# EAGLE schematic pdp8l (EAGLE 6.6.0), part 2 of 2
## Sheet 12 of 23
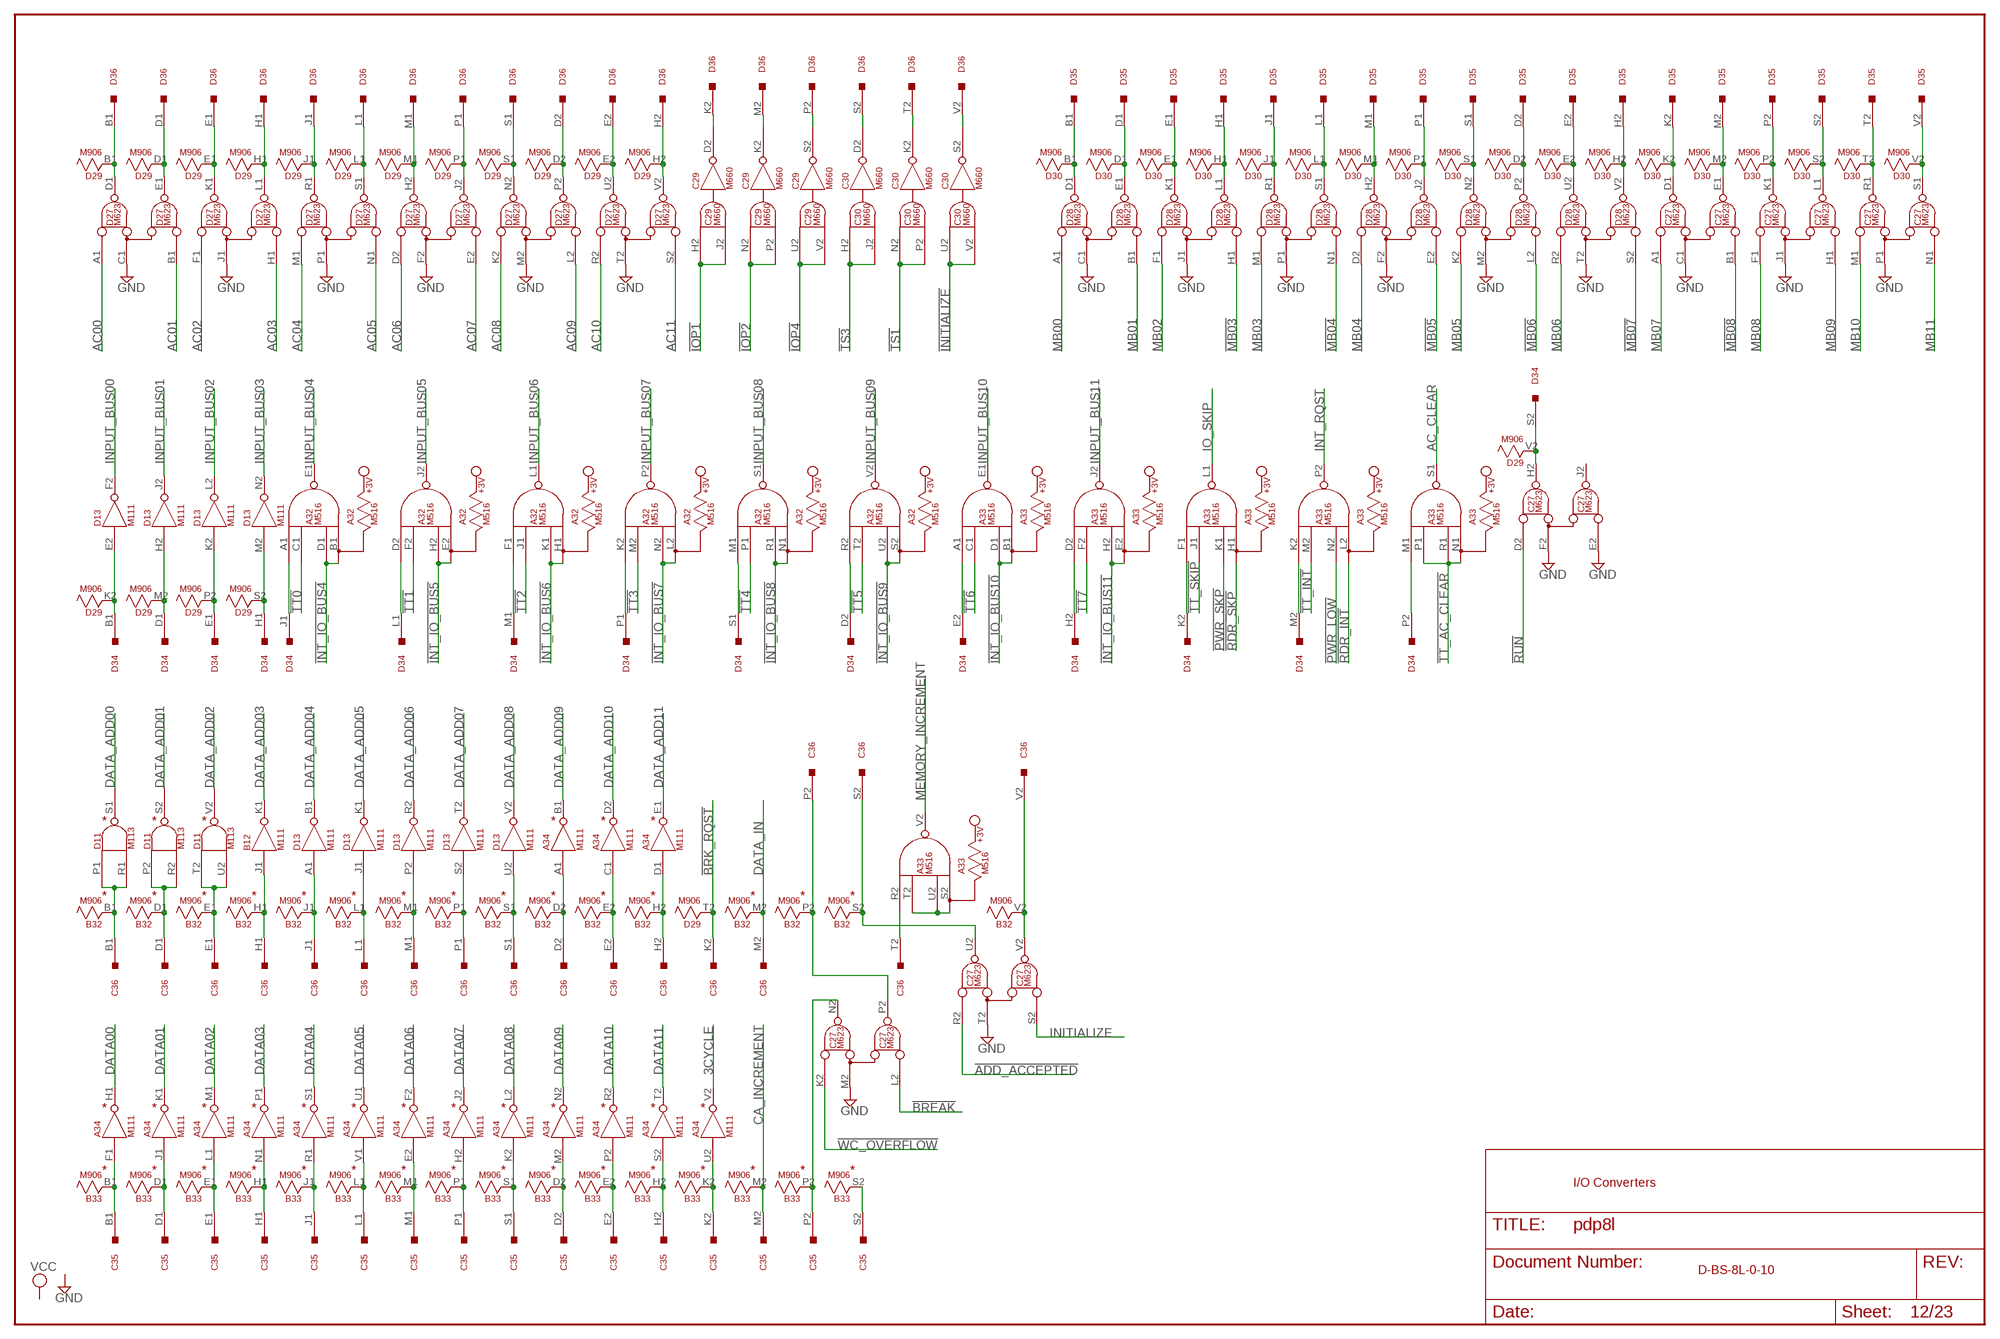
[diagram p11: schematic, sheet 12]

### Parts
A32  M516  [H807]
A33  M516  [H807]
A34  M111  [H807]
B32  M906  [H807]
B33  M906  [H807]
C27  M623  [H807]
C29  M660  [H807]
C30  M660  [H807]
C35  M903  [H807]
C36  M903  [H807]
D27  M623  [H807]
D28  M623  [H807]
D29  M906  [H807]
D30  M906  [H807]
D34  M903  [H807]
D35  M903  [H807]
D36  M903  [H807]

### Nets
3CYCLE: A34.V2(V2:OUT) ; also sheet 2
!3CYCLE: A34.U2(V2:IN) B33.K2 C35.K2
!ADD_ACCEPTED: C27.R2(U2:A) ; also sheet 6
!BAC_CLEAR: A33.M1(S1:IN) D34.P2
!BADD_ACCEPTED: B32.S2 C27.U2(U2:D) C36.S2
!BADDR00: B32.B1 C36.B1 D11.P1(S1:IN1) D11.R1(S1:IN2)
!BADDR01: B32.D1 C36.D1 D11.P2(S2:IN1) D11.R2(S2:IN2)
!BADDR02: B32.E1 C36.E1 D11.T2(V2:IN1) D11.U2(V2:IN2)
!BADDR03: B12.J1(K1:IN) B32.H1 C36.H1
!BADDR04: B32.J1 C36.J1 D13.A1(B1:IN)
!BADDR05: B32.L1 C36.L1 D13.J1(K1:IN)
!BADDR06: B32.M1 C36.M1 D13.P2(R2:IN)
!BADDR07: B32.P1 C36.P1 D13.S2(T2:IN)
!BADDR08: B32.S1 C36.S1 D13.U2(V2:IN)
!BADDR09: A34.A1(B1:IN) B32.D2 C36.D2
!BADDR10: A34.C1(D2:IN) B32.E2 C36.E2
!BADDR11: A34.D1(E1:IN) B32.H2 C36.H2
!BBREAK: B32.P2 C27.P2(N2:E) C36.P2
!BDATA00: A34.F1(H1:IN) B33.B1 C35.B1
!BDATA01: A34.J1(K1:IN) B33.D1 C35.D1
!BDATA02: A34.L1(M1:IN) B33.E1 C35.E1
!BDATA03: A34.N1(P1:IN) B33.H1 C35.H1
!BDATA04: A34.R1(S1:IN) B33.J1 C35.J1
!BDATA05: A34.V1(U1:IN) B33.L1 C35.L1
!BDATA06: A34.E2(F2:IN) B33.M1 C35.M1
!BDATA07: A34.H2(J2:IN) B33.P1 C35.P1
!BDATA08: A34.K2(L2:IN) B33.S1 C35.S1
!BDATA09: A34.M2(N2:IN) B33.D2 C35.D2
!BDATA10: A34.P2(R2:IN) B33.E2 C35.E2
!BDATA11: A34.S2(T2:IN) B33.H2 C35.H2
!BIRQ: A33.K2(P2:IN) D34.M2
!BMB03: D28.L1(K1:E) D30.H1 D35.H1
!BMB04: D28.S1(R1:E) D30.L1 D35.L1
!BMB05: D28.J2(H2:E) D30.P1 D35.P1
!BMB06: D28.P2(N2:E) D30.D2 D35.D2
!BMB07: D28.V2(U2:E) D30.H2 D35.H2
!BMB08: C27.E1(D1:E) D30.M2 D35.M2
!BMEM_INCR: A33.R2(V2:IN) C36.T2
!BREAK: C27.L2(N2:B) ; also sheet 2
!BRK_RQST: C36.K2 D29.T2 ; also sheet 2
!BSKIP: A33.F1(L1:IN) D34.K2
!EXT_ADD2: B33.S2 C35.S2
!IB00: D13.E2(F2:IN) D29.K2 D34.B1
!IB01: D13.H2(J2:IN) D29.M2 D34.D1
!IB02: D13.K2(L2:IN) D29.P2 D34.E1
!IB03: D13.M2(N2:IN) D29.S2 D34.H1
!IB04: A32.A1(E1:IN) D34.J1
!IB05: A32.D2(J2:IN) D34.L1
!IB06: A32.F1(L1:IN) D34.M1
!IB07: A32.K2(P2:IN) D34.P1
!IB08: A32.M1(S1:IN) D34.S1
!IB09: A32.R2(V2:IN) D34.D2
!IB10: A33.A1(E1:IN) D34.E2
!IB11: A33.D2(J2:IN) D34.H2
!INITIALIZE: C30.U2(S:IN1) C30.V2(S:IN2) ; also sheet 1,21,22
!INT_IO_BUS4: A32.B1(E1:IN2) A32.D1(E1:IN4) ; also sheet 22
!INT_IO_BUS5: A32.E2(J2:IN2) A32.H2(J2:IN4) ; also sheet 22
!INT_IO_BUS6: A32.H1(L1:IN2) A32.K1(L1:IN4) ; also sheet 22
!INT_IO_BUS7: A32.L2(P2:IN2) A32.N2(P2:IN4) ; also sheet 22
!INT_IO_BUS8: A32.N1(S1:IN2) A32.R1(S1:IN4) ; also sheet 22
!INT_IO_BUS9: A32.S2(V2:IN2) A32.U2(V2:IN4) ; also sheet 22
!INT_IO_BUS10: A33.B1(E1:IN2) A33.D1(E1:IN4) ; also sheet 22
!INT_IO_BUS11: A33.E2(J2:IN2) A33.H2(J2:IN4) ; also sheet 22
!IOP1: C29.H2(D:IN1) C29.J2(D:IN2) ; also sheet 1,3
!IOP2: C29.N2(K:IN1) C29.P2(K:IN2) ; also sheet 1,3
!IOP4: C29.U2(S:IN1) C29.V2(S:IN2) ; also sheet 1,3
!MB03: D28.H1(K1:B) ; also sheet 2,3,6,7,13,14,16,20,21,22,23
!MB04: D28.N1(R1:B) ; also sheet 3,6,7,13,14,16,20,21,22,23
!MB05: D28.E2(H2:B) ; also sheet 3,6,7,13,14,16,21,22,23
!MB06: D28.L2(N2:B) ; also sheet 3,6,7,13,16,20,21,22,23
!MB07: D28.S2(U2:B) ; also sheet 3,6,7,14,16,20,22,23
!MB08: C27.B1(D1:B) ; also sheet 4,5,6,7,14,16,20,21,23
!PWR_LOW: A33.N2(P2:IN4) ; also sheet 20
!PWR_SKP: A33.K1(L1:IN4) ; also sheet 20
!RDR_INT: A33.L2(P2:IN2) ; also sheet 21,22
!RDR_SKP: A33.H1(L1:IN2) ; also sheet 21,22
!RUN: C27.D2(H2:A) ; also sheet 1
!TS1: C30.N2(K:IN1) C30.P2(K:IN2) ; also sheet 1
!TS3: C30.H2(D:IN1) C30.J2(D:IN2) ; also sheet 1
!TT0: A32.C1(E1:IN3) ; also sheet 13
!TT1: A32.F2(J2:IN3) ; also sheet 13
!TT2: A32.J1(L1:IN3) ; also sheet 13
!TT3: A32.M2(P2:IN3) ; also sheet 13
!TT4: A32.P1(S1:IN3) ; also sheet 13
!TT5: A32.T2(V2:IN3) ; also sheet 13
!TT6: A33.C1(E1:IN3) ; also sheet 13
!TT7: A33.F2(J2:IN3) ; also sheet 13
!TT_AC_CLEAR: A33.N1(S1:IN2) A33.P1(S1:IN3) A33.R1(S1:IN4) ; also sheet 13
!TT_INT: A33.M2(P2:IN3) ; also sheet 14
!TT_SKIP: A33.J1(L1:IN3) ; also sheet 14
!WC_OVERFLOW: C27.K2(N2:A) ; also sheet 6
A33S2: A33.S2(V2:IN2) A33.T2(V2:IN3) A33.U2(V2:IN4)
AC00: D27.A1(D1:A) ; also sheet 5,7
AC01: D27.B1(D1:B) ; also sheet 7
AC02: D27.F1(K1:A) ; also sheet 7
AC03: D27.H1(K1:B) ; also sheet 7
AC04: D27.M1(R1:A) ; also sheet 7,14,21
AC05: D27.N1(R1:B) ; also sheet 7,14,21
AC06: D27.D2(H2:A) ; also sheet 7,14,21
AC07: D27.E2(H2:B) ; also sheet 7,14,21
AC08: D27.K2(N2:A) ; also sheet 7,14,21
AC09: D27.L2(N2:B) ; also sheet 7,14,21
AC10: D27.R2(U2:A) ; also sheet 7,14,21
AC11: D27.S2(U2:B) ; also sheet 7,14,21
AC_CLEAR: A33.S1(S1:OUT) ; also sheet 3
BAC00: D27.D1(D1:D) D29.B1 D36.B1
BAC01: D27.E1(D1:E) D29.D1 D36.D1
BAC02: D27.K1(K1:D) D29.E1 D36.E1
BAC03: D27.L1(K1:E) D29.H1 D36.H1
BAC04: D27.R1(R1:D) D29.J1 D36.J1
BAC05: D27.S1(R1:E) D29.L1 D36.L1
BAC06: D27.H2(H2:D) D29.M1 D36.M1
BAC07: D27.J2(H2:E) D29.P1 D36.P1
BAC08: D27.N2(N2:D) D29.S1 D36.S1
BAC09: D27.P2(N2:E) D29.D2 D36.D2
BAC10: D27.U2(U2:D) D29.E2 D36.E2
BAC11: D27.V2(U2:E) D29.H2 D36.H2
BINITIALIZE: C30.S2(S:OUT) D36.V2
BINITIALIZE2: B32.V2 C27.V2(U2:E) C36.V2
BIOP1: C29.D2(D:OUT) D36.K2
BIOP2: C29.K2(K:OUT) D36.M2
BIOP4: C29.S2(S:OUT) D36.P2
BMB00: D28.D1(D1:D) D30.B1 D35.B1
BMB01: D28.E1(D1:E) D30.D1 D35.D1
BMB02: D28.K1(K1:D) D30.E1 D35.E1
BMB03: D28.R1(R1:D) D30.J1 D35.J1
BMB04: D28.H2(H2:D) D30.M1 D35.M1
BMB05: D28.N2(N2:D) D30.S1 D35.S1
BMB06: D28.U2(U2:D) D30.E2 D35.E2
BMB07: C27.D1(D1:D) D30.K2 D35.K2
BMB08: C27.K1(K1:D) D30.P2 D35.P2
BMB09: C27.L1(K1:E) D30.S2 D35.S2
BMB10: C27.R1(R1:D) D30.T2 D35.T2
BMB11: C27.S1(R1:E) D30.V2 D35.V2
BRUN: C27.H2(H2:D) D29.V2 D34.S2
BTS1: C30.K2(K:OUT) D36.T2
BTS3: C30.D2(D:OUT) D36.S2
CA_INCREMENT: B33.M2 C35.M2 ; also sheet 4
DATA00: A34.H1(H1:OUT) ; also sheet 8
DATA01: A34.K1(K1:OUT) ; also sheet 8
DATA02: A34.M1(M1:OUT) ; also sheet 8
DATA03: A34.P1(P1:OUT) ; also sheet 9
DATA04: A34.S1(S1:OUT) ; also sheet 9
DATA05: A34.U1(U1:OUT) ; also sheet 9
DATA06: A34.F2(F2:OUT) ; also sheet 10
DATA07: A34.J2(J2:OUT) ; also sheet 10
DATA08: A34.L2(L2:OUT) ; also sheet 10
DATA09: A34.N2(N2:OUT) ; also sheet 11
DATA10: A34.R2(R2:OUT) ; also sheet 11
DATA11: A34.T2(T2:OUT) ; also sheet 11
DATA_ADD00: D11.S1(S1:OUT) ; also sheet 8
DATA_ADD01: D11.S2(S2:OUT) ; also sheet 8
DATA_ADD02: D11.V2(V2:OUT) ; also sheet 8
DATA_ADD03: B12.K1(K1:OUT) ; also sheet 9
DATA_ADD04: D13.B1(B1:OUT) ; also sheet 9
DATA_ADD05: D13.K1(K1:OUT) ; also sheet 9
DATA_ADD06: D13.R2(R2:OUT) ; also sheet 10
DATA_ADD07: D13.T2(T2:OUT) ; also sheet 10
DATA_ADD08: D13.V2(V2:OUT) ; also sheet 10
DATA_ADD09: A34.B1(B1:OUT) ; also sheet 11
DATA_ADD10: A34.D2(D2:OUT) ; also sheet 11
DATA_ADD11: A34.E1(E1:OUT) ; also sheet 11
DATA_IN: B32.M2 C36.M2 ; also sheet 3
GND [Supply]: C27.C1(D1:C) C27.E2(H2:B) C27.F2(H2:C) C27.J1(K1:C) C27.M2(N2:C) C27.P1(R1:C) C27.T2(U2:C) D27.C1(D1:C) D27.F2(H2:C) D27.J1(K1:C) D27.M2(N2:C) D27.P1(R1:C) D27.T2(U2:C) D28.C1(D1:C) D28.F2(H2:C) D28.J1(K1:C) D28.M2(N2:C) D28.P1(R1:C) D28.T2(U2:C) ; also sheet 1,3,8,9,10,11,13,14,15,16,19,20,21,23
INITIALIZE: C27.S2(U2:B) ; also sheet 1,13,14
INPUT_BUS00: D13.F2(F2:OUT) ; also sheet 8
INPUT_BUS01: D13.J2(J2:OUT) ; also sheet 8
INPUT_BUS02: D13.L2(L2:OUT) ; also sheet 8
INPUT_BUS03: D13.N2(N2:OUT) ; also sheet 9
INPUT_BUS04: A32.E1(E1:OUT) ; also sheet 9
INPUT_BUS05: A32.J2(J2:OUT) ; also sheet 9
INPUT_BUS06: A32.L1(L1:OUT) ; also sheet 10
INPUT_BUS07: A32.P2(P2:OUT) ; also sheet 10
INPUT_BUS08: A32.S1(S1:OUT) ; also sheet 10
INPUT_BUS09: A32.V2(V2:OUT) ; also sheet 11
INPUT_BUS10: A33.E1(E1:OUT) ; also sheet 11
INPUT_BUS11: A33.J2(J2:OUT) ; also sheet 11
INT_RQST: A33.P2(P2:OUT) ; also sheet 6
IO_SKIP: A33.L1(L1:OUT) ; also sheet 5
MB00: D28.A1(D1:A) ; also sheet 7,23
MB01: D28.B1(D1:B) ; also sheet 7,23
MB02: D28.F1(K1:A) ; also sheet 7,23
MB03: D28.M1(R1:A) ; also sheet 2,7,23
MB04: D28.D2(H2:A) ; also sheet 3,7,23
MB05: D28.K2(N2:A) ; also sheet 3,5,7,20,23
MB06: D28.R2(U2:A) ; also sheet 3,5,7,14,23
MB07: C27.A1(D1:A) ; also sheet 3,5,7,13,21,23
MB08: C27.F1(K1:A) ; also sheet 4,5,7,13,22,23
MB09: C27.H1(K1:B) ; also sheet 1,3,4,7,23
MB10: C27.M1(R1:A) ; also sheet 1,4,7,23
MB11: C27.N1(R1:B) ; also sheet 1,4,7,23
MEMORY_INCREMENT: A33.V2(V2:OUT) ; also sheet 4,6
WC_OVERFLOW: B33.P2 C27.N2(N2:D) C35.P2
Unconnected: B32.K2 B32.T2 B33.T2 B33.V2 C27.J2(H2:E) C35.T2 C35.V2 D34.T2 D34.V2

### Notes on the sheet
- * | * | * | * | * | *
- * | * | * | * | * | * | * | * | * | * | * | * | * | * | *
- * | * | * | * | * | * | * | * | * | * | * | * | *
- * | * | * | * | * | * | * | * | * | * | * | * | * | * | * | *
- I/O Converters
- D-BS-8L-0-10

## Sheet 13 of 23
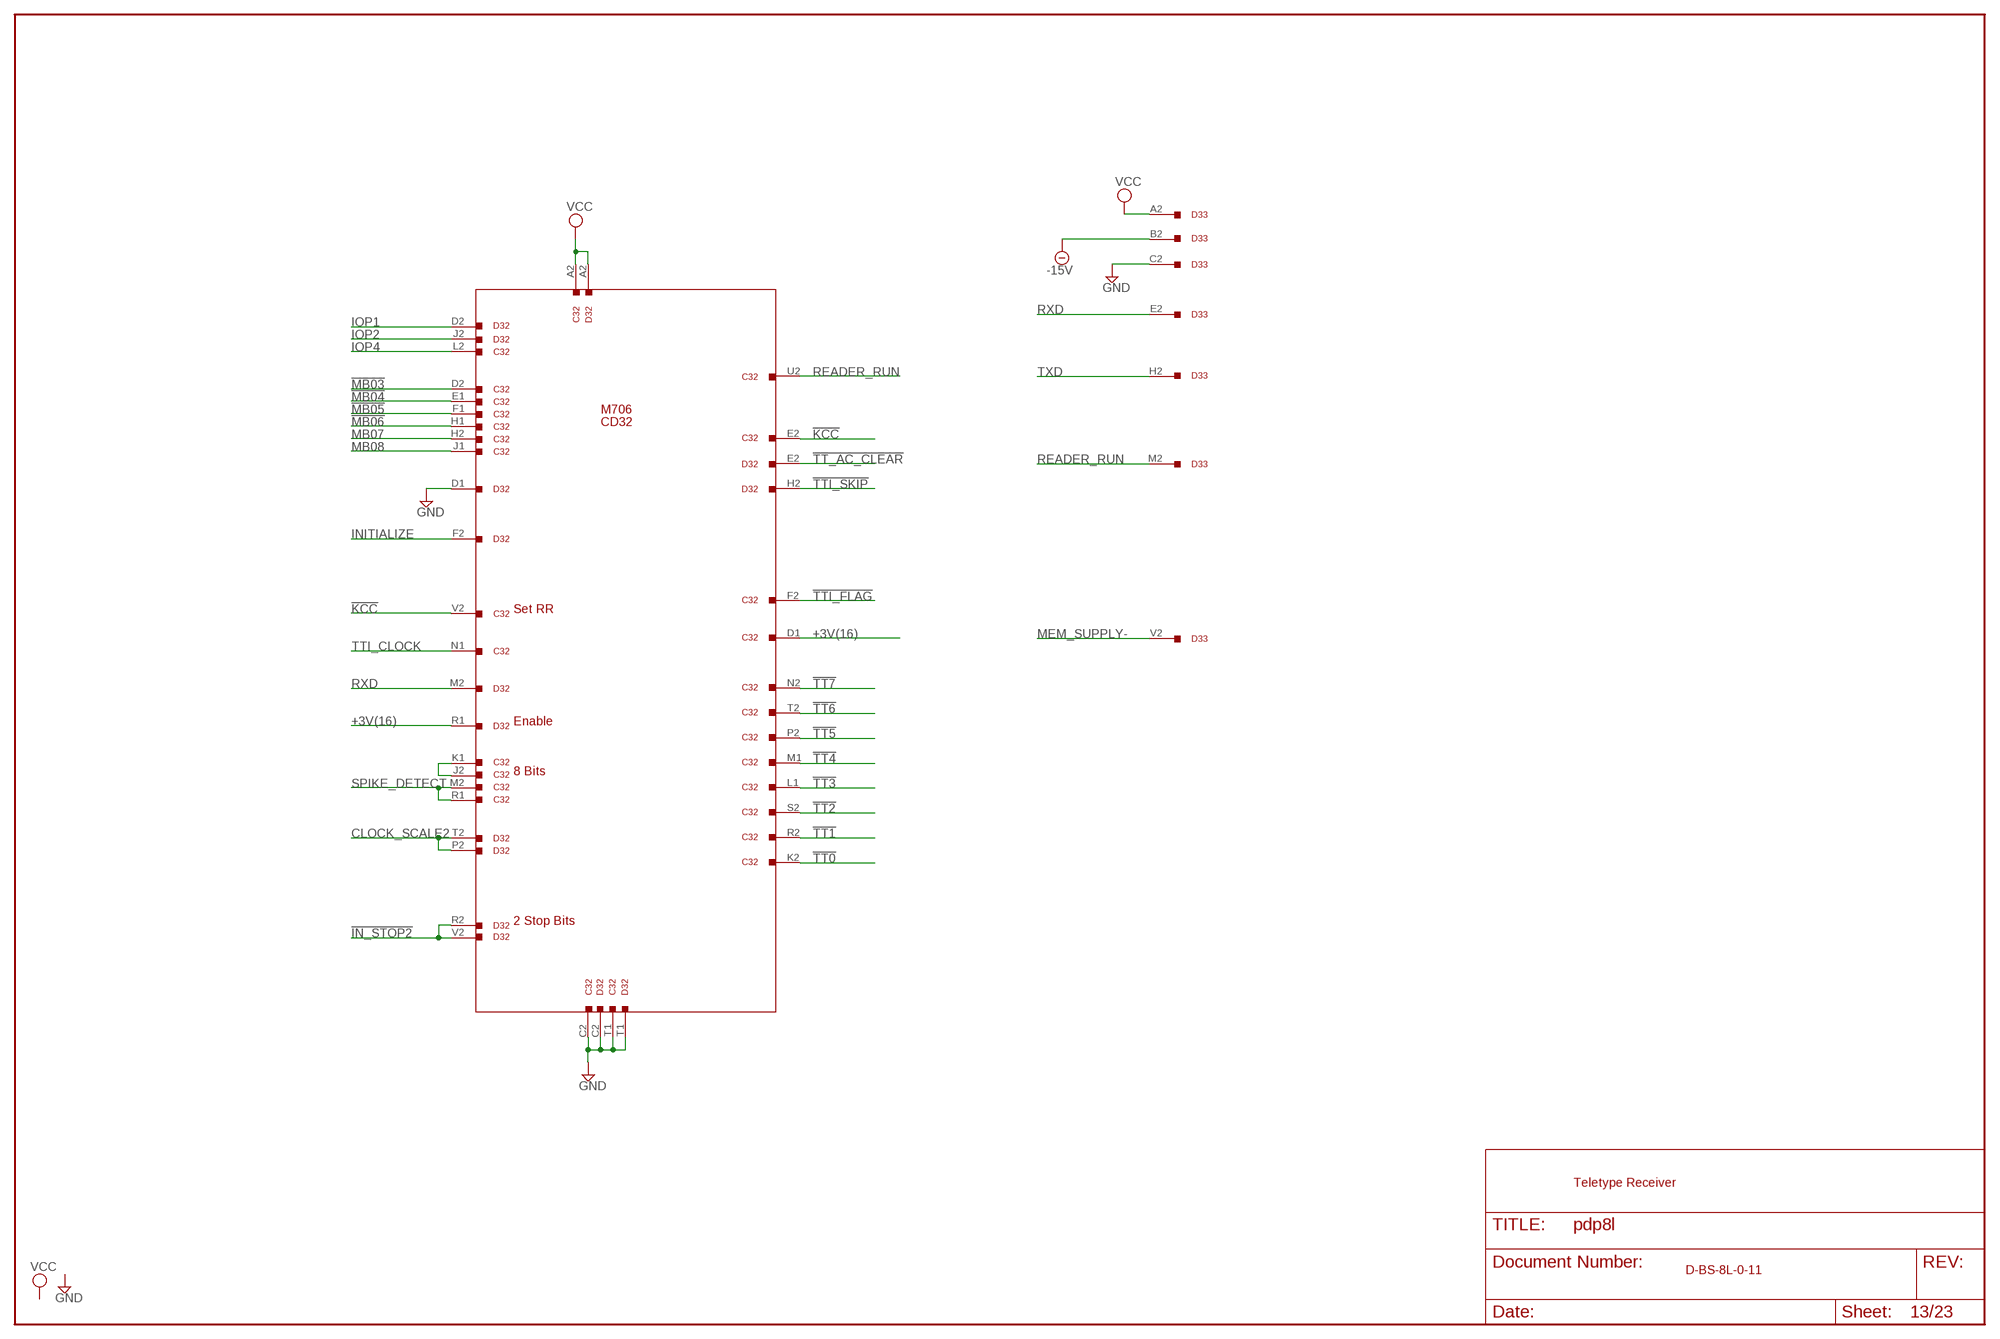
[diagram p12: schematic, sheet 13]

### Parts
C32  M706A  M916  [H807]
D32  M706B  M916  [H807]
D33  W076  W023  [H807]

### Nets
!IN_STOP2: D32.R2 D32.V2
!KCC: C32.E2 C32.V2
!MB03: C32.D2 ; also sheet 2,3,6,7,12,14,16,20,21,22,23
!MB04: C32.E1 ; also sheet 3,6,7,12,14,16,20,21,22,23
!MB05: C32.F1 ; also sheet 3,6,7,12,14,16,21,22,23
!MB06: C32.H1 ; also sheet 3,6,7,12,16,20,21,22,23
!TT0: C32.K2 ; also sheet 12
!TT1: C32.R2 ; also sheet 12
!TT2: C32.S2 ; also sheet 12
!TT3: C32.L1 ; also sheet 12
!TT4: C32.M1 ; also sheet 12
!TT5: C32.P2 ; also sheet 12
!TT6: C32.T2 ; also sheet 12
!TT7: C32.N2 ; also sheet 12
!TT_AC_CLEAR: D32.E2 ; also sheet 12
!TTI_FLAG: C32.F2 ; also sheet 14
!TTI_SKIP: D32.H2 ; also sheet 14
+3V(16): C32.D1 D32.R1
-15V [Supply]: D33.B2 ; also sheet 22
CLOCK_SCALE2: D32.P2 D32.T2
GND [Supply]: C32.C2 C32.T1 D32.C2 D32.D1 D32.T1 D33.C2 ; also sheet 1,3,8,9,10,11,12,14,15,16,19,20,21,23
INITIALIZE: D32.F2 ; also sheet 1,12,14
IOP1: D32.D2 ; also sheet 1,14,21,22,23
IOP2: D32.J2 ; also sheet 1,14,20,21,22
IOP4: C32.L2 ; also sheet 1,14,21,22,23
MB07: C32.H2 ; also sheet 3,5,7,12,21,23
MB08: C32.J1 ; also sheet 4,5,7,12,22,23
MEM_SUPPLY- [Supply]: D33.V2 ; also sheet 15,16
READER_RUN: C32.U2 D33.M2
RXD: D32.M2 D33.E2
SPIKE_DETECT: C32.M2 C32.R1
TTI_CLOCK: C32.N1 ; also sheet 14
TTY8BITS: C32.J2 C32.K1
TXD: D33.H2 ; also sheet 14
VCC [Supply]: C32.A2 D32.A2 D33.A2 ; also sheet 14,15,19,20
Unconnected: C32.A1 C32.B1 C32.B2 C32.C1 C32.P1 C32.S1 C32.U1 C32.V1 D32.A1 D32.B1 D32.B2 D32.C1 D32.E1 D32.F1 D32.H1 D32.J1 D32.K1 D32.K2 D32.L1 D32.L2 D32.M1 D32.N1 D32.N2 D32.P1 D32.S1 D32.S2 D32.U1 D32.U2 D32.V1 D33.D2 D33.F2 D33.J2 D33.K2 D33.L2 D33.N2 D33.P2 D33.R2 D33.S2 D33.T2 D33.U2

### Notes on the sheet
- M706
- CD32
- Set RR
- Enable
- 8 Bits
- 2 Stop Bits
- Teletype Receiver
- D-BS-8L-0-11

## Sheet 14 of 23
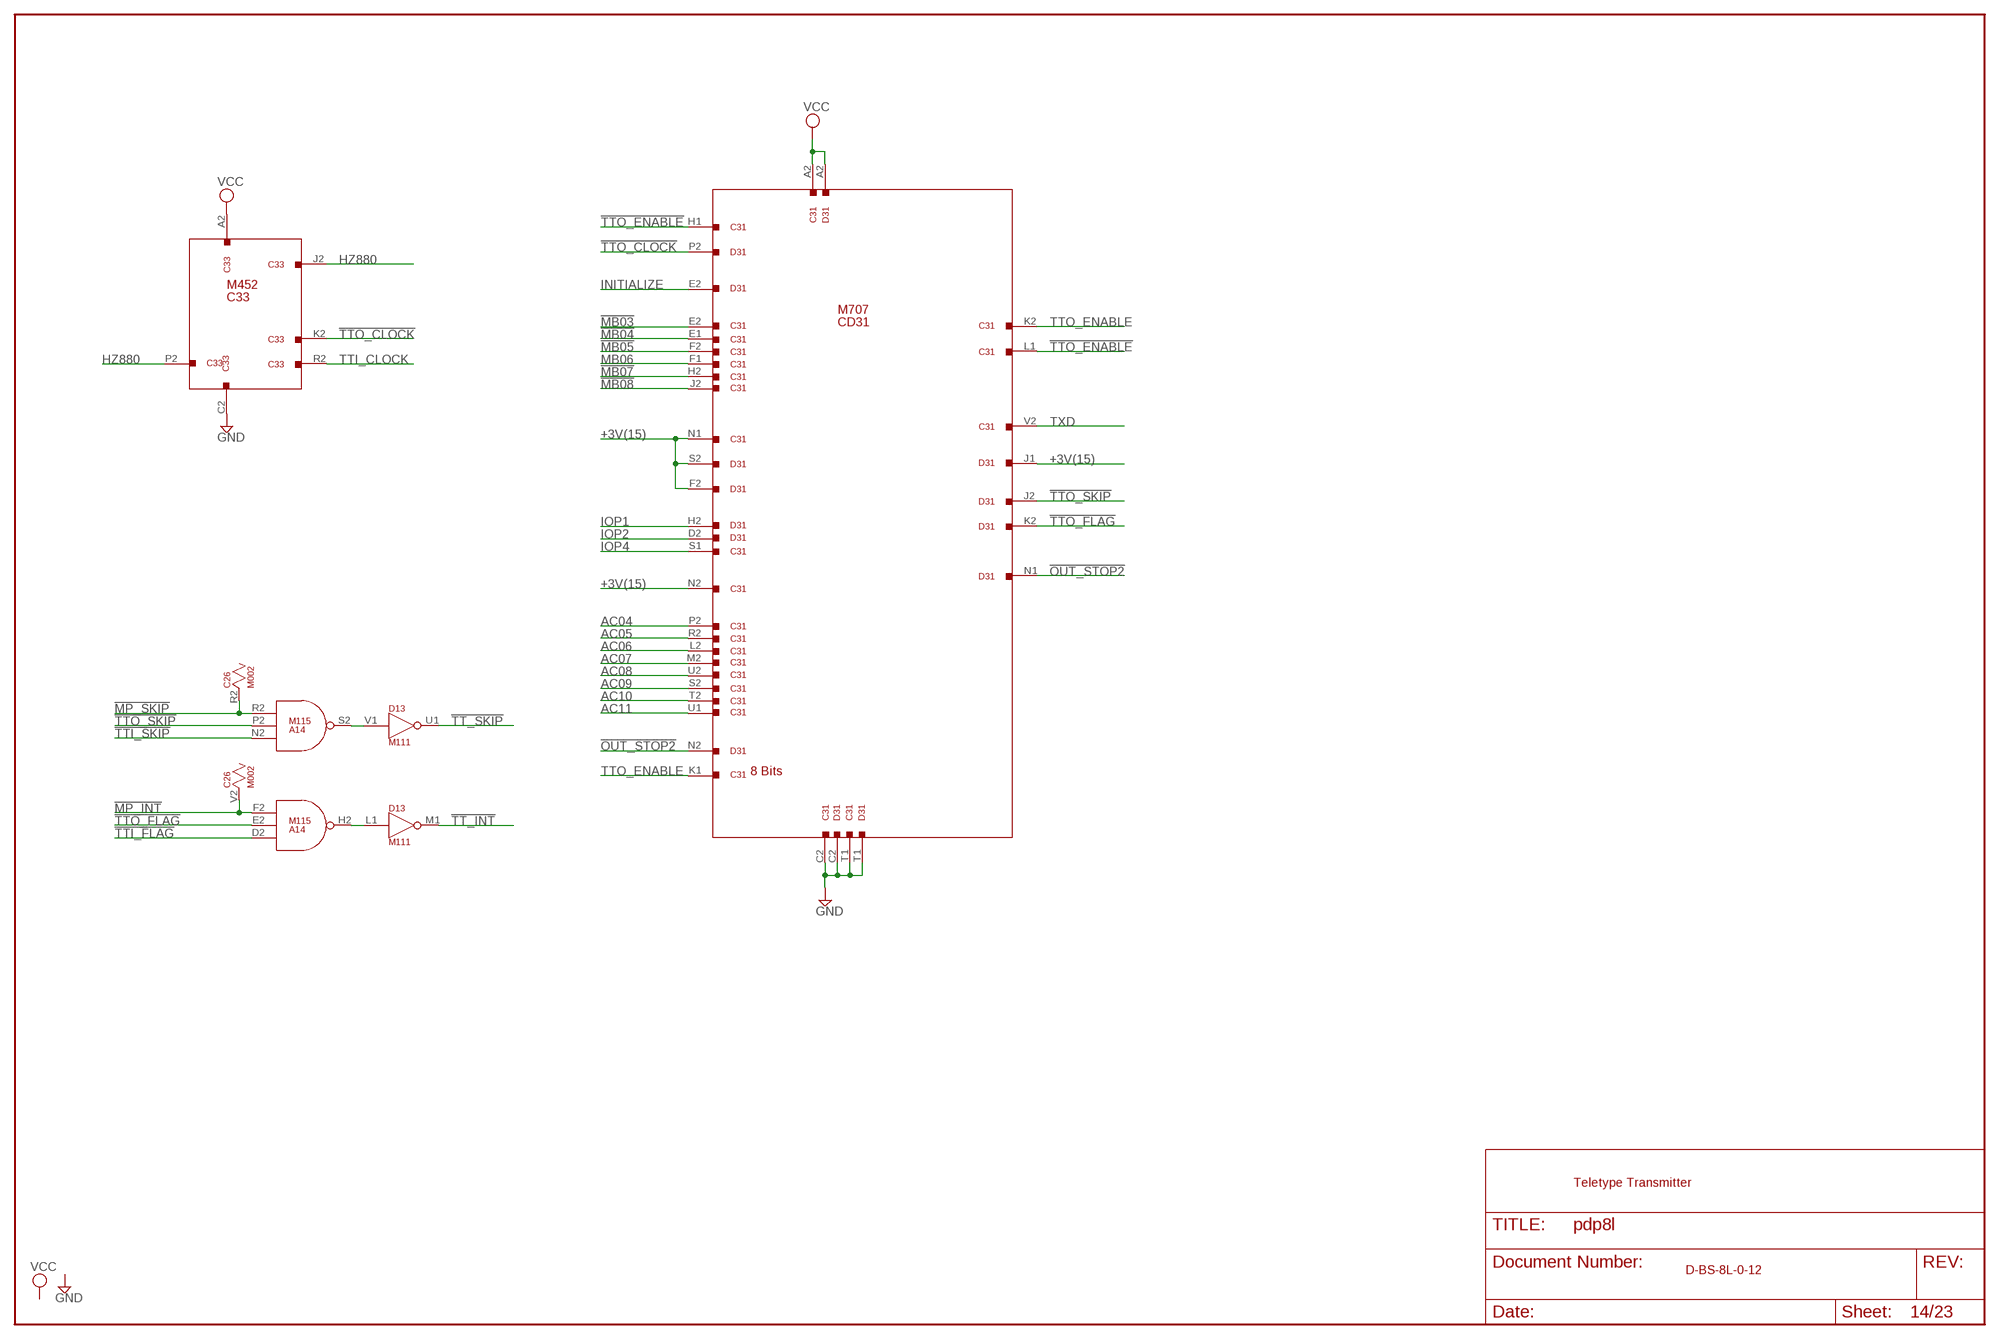
[diagram p13: schematic, sheet 14]

### Parts
C31  M707A  M916  [H807]
C33  M452  W023  [H807]
D31  M707B  M916  [H807]

### Nets
!MB03: C31.E2 ; also sheet 2,3,6,7,12,13,16,20,21,22,23
!MB04: C31.E1 ; also sheet 3,6,7,12,13,16,20,21,22,23
!MB05: C31.F2 ; also sheet 3,6,7,12,13,16,21,22,23
!MB07: C31.H2 ; also sheet 3,6,7,12,16,20,22,23
!MB08: C31.J2 ; also sheet 4,5,6,7,12,16,20,21,23
!MP_INT: A14.F2(H2:IN3) C26.V2 ; also sheet 23
!MP_SKIP: A14.R2(S2:IN3) C26.R2 ; also sheet 23
!OUT_STOP2: D31.N1 D31.N2
!TT_INT: D13.M1(M1:OUT) ; also sheet 12
!TT_SKIP: D13.U1(U1:OUT) ; also sheet 12
!TTI_FLAG: A14.D2(H2:IN1) ; also sheet 13
!TTI_SKIP: A14.N2(S2:IN1) ; also sheet 13
!TTO_CLOCK: C33.K2 D31.P2
!TTO_ENABLE: C31.H1 C31.L1
!TTO_FLAG: A14.E2(H2:IN2) D31.K2
!TTO_SKIP: A14.P2(S2:IN2) D31.J2
+3V(15): C31.N1 C31.N2 D31.F2 D31.J1 D31.S2
AC04: C31.P2 ; also sheet 7,12,21
AC05: C31.R2 ; also sheet 7,12,21
AC06: C31.L2 ; also sheet 7,12,21
AC07: C31.M2 ; also sheet 7,12,21
AC08: C31.U2 ; also sheet 7,12,21
AC09: C31.S2 ; also sheet 7,12,21
AC10: C31.T2 ; also sheet 7,12,21
AC11: C31.U1 ; also sheet 7,12,21
GND [Supply]: C31.C2 C31.T1 C33.C2 D31.C2 D31.T1 ; also sheet 1,3,8,9,10,11,12,13,15,16,19,20,21,23
HZ880: C33.J2 C33.P2
INITIALIZE: D31.E2 ; also sheet 1,12,13
IOP1: D31.H2 ; also sheet 1,13,21,22,23
IOP2: D31.D2 ; also sheet 1,13,20,21,22
IOP4: C31.S1 ; also sheet 1,13,21,22,23
MB06: C31.F1 ; also sheet 3,5,7,12,23
TT_INT: A14.H2(H2:OUT) D13.L1(M1:IN)
TT_SKIP: A14.S2(S2:OUT) D13.V1(U1:IN)
TTI_CLOCK: C33.R2 ; also sheet 13
TTO_ENABLE: C31.K1 C31.K2
TXD: C31.V2 ; also sheet 13
VCC [Supply]: C31.A2 C33.A2 D31.A2 ; also sheet 13,15,19,20
Unconnected: C31.A1 C31.B1 C31.B2 C31.C1 C31.D1 C31.D2 C31.J1 C31.M1 C31.P1 C31.R1 C31.V1 C33.B2 C33.D2 C33.E2 C33.F2 C33.H2 C33.L2 C33.M2 C33.N2 C33.S2 C33.T2 C33.U2 C33.V2 D31.A1 D31.B1 D31.B2 D31.C1 D31.D1 D31.E1 D31.F1 D31.H1 D31.K1 D31.L1 D31.L2 D31.M1 D31.M2 D31.P1 D31.R1 D31.R2 D31.S1 D31.T2 D31.U1 D31.U2 D31.V1 D31.V2

### Notes on the sheet
- M452
- C33
- M707
- CD31
- 8 Bits
- Teletype Transmitter
- D-BS-8L-0-12

## Sheet 15 of 23
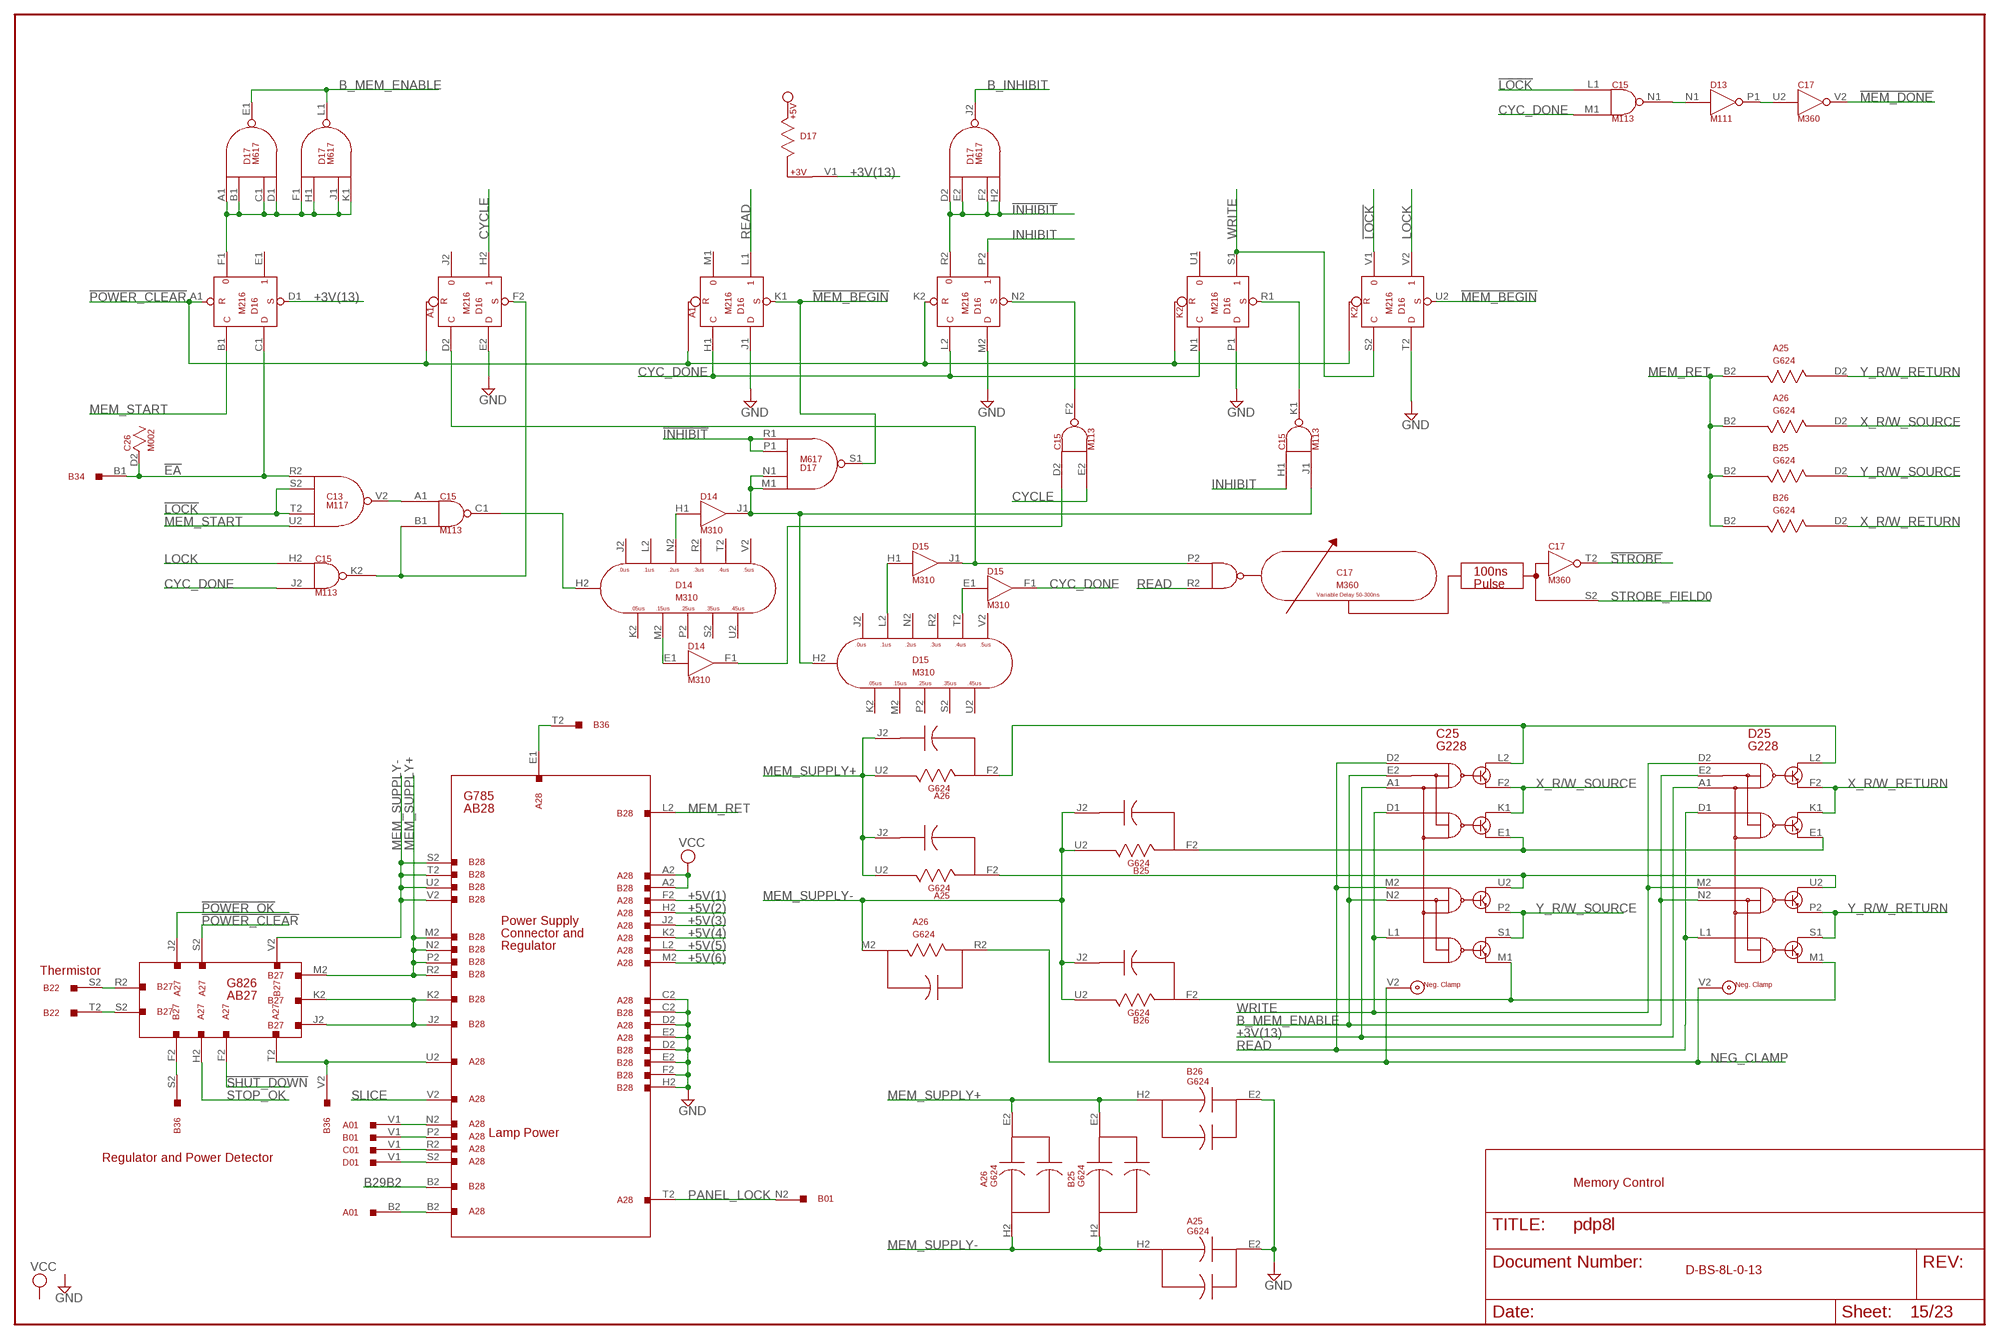
[diagram p14: schematic, sheet 15]

### Parts
A25  G624  [H807]
A26  G624  [H807]
A27  G826A  W023  [H807]
A28  G785A  M916  [H807]
B22  W025B  W023  [H807]
B25  G624  [H807]
B26  G624  [H807]
B27  G826B  W023  [H807]
B28  G785B  W023  [H807]
C17  M360  [H807]
C25  G228  [H807]
D14  M310  [H807]
D15  M310  [H807]
D16  M216  M206X  [H807]
D17  M617  [H807]
D25  G228  [H807]

### Nets
!B_MEM_ENABLE: D16.F1 D17.A1(E1:IN1) D17.B1(E1:IN2) D17.C1(E1:IN3) D17.D1(E1:IN4) D17.F1(L1:IN1) D17.H1(L1:IN2) D17.J1(L1:IN3) D17.K1(L1:IN4)
!EA: B34.B1 C13.R2(V2:IN1) C26.D2 D16.C1(E1:D)
!INHIBIT: D16.R2 D17.D2(J2:IN1) D17.E2(J2:IN2) D17.F2(J2:IN3) D17.H2(J2:IN4) D17.P1(S1:IN3) D17.R1(S1:IN4)
!LOCK: C13.S2(V2:IN2) C13.T2(V2:IN3) C15.L1(N1:IN1) D16.V1
!MEM_BEGIN: D16.K1(L1:S) D16.U2(V2:S) D17.S1(S1:OUT) ; also sheet 16
!MEM_DONE: C17.V2(OUT) ; also sheet 1,6
!POWER_CLEAR: A27.S2 D16.A1(E1:R) D16.K2(P2:R) ; also sheet 1
!POWER_OK: A27.J2 ; also sheet 1
!SHUT_DOWN: A27.F2 ; also sheet 20
!STROBE: C17.T2(T) ; also sheet 1,6
+3V(13): C25.A1 D16.D1(E1:S) D17.V1 D25.A1 ; also sheet 5
+5V(1) [Supply]: A28.F2
+5V(2) [Supply]: A28.H2
+5V(3) [Supply]: A28.J2
+5V(4) [Supply]: A28.K2
+5V(5) [Supply]: A28.L2
+5V(6) [Supply]: A28.M2
A01_10V [Supply]: A01.V1 A28.N2
A01B2 [Supply]: A01.B2 A28.B2
A25F2: A25.F2 C25.U2 D25.U2
A26F2: A26.F2 C25.L2 D25.L2
B01_10V [Supply]: A28.P2 B01.V1
B22S2: B22.S2 B27.R2
B22T2: B22.T2 B27.S2
B25F2: B25.F2 C25.E1 D25.E1
B26F2: B26.F2 C25.M1 D25.M1
B27K2: B27.J2 B27.K2 B28.J2 B28.K2
B29B2 [Supply]: B28.B2 ; also sheet 22
B36S2: B27.F2 B36.S2
B36T2: A28.E1 B36.T2
B36V2: A27.T2 A28.U2 B36.V2
B_INHIBIT: D17.J2(J2:OUT) ; also sheet 16
B_MEM_ENABLE: C25.E2 C25.N2 D17.E1(E1:OUT) D17.L1(L1:OUT) D25.E2 D25.N2 ; also sheet 16,17,18
C01_10V [Supply]: A28.R2 C01.V1
C13V2: C13.V2(V2:OUT) C15.A1(C1:IN1)
C15C1: C15.C1(C1:OUT) D14.H2(H2:H2)
C15F2: C15.F2(F2:OUT) D16.N2(P2:S)
C15K1: C15.K1(K1:OUT) D16.R1(S1:S)
C15K2: C15.B1(C1:IN2) C15.K2(K2:OUT) D16.F2(H2:S)
CYC_DONE: C15.J2(K2:IN2) C15.M1(N1:IN2) D15.F1(F1:OUT) D16.H1(L1:C) D16.L2(P2:C) D16.N1(S1:C)
CYCLE: C15.E2(F2:IN2) D16.H2
D01_10V [Supply]: A28.S2 D01.V1
D14F1: C15.D2(F2:IN1) D14.F1(F1:OUT)
D14J1: C15.J1(K1:IN2) D14.J1(J1:OUT) D15.H2(H2:H2) D17.M1(S1:IN1) D17.N1(S1:IN2)
D14M2: D14.E1(F1:IN) D14.M2(H2:M2)
D14N2: D14.H1(J1:IN) D14.N2(H2:N2)
D15J1: C17.P2(P) D15.J1(J1:OUT) D16.D2(H2:C)
D15L2: D15.H1(J1:IN) D15.L2(H2:L2)
D15T2: D15.E1(F1:IN) D15.T2(H2:T2)
GND [Supply]: A25.E2 A28.C2 A28.D2 A28.E2 B26.E2 B28.C2 B28.D2 B28.E2 B28.F2 B28.H2 D16.E2(H2:D) D16.J1(L1:D) D16.M2(P2:D) D16.P1(S1:D) D16.T2(V2:D) ; also sheet 1,3,8,9,10,11,12,13,14,16,19,20,21,23
INHIBIT: C15.H1(K1:IN1) D16.P2
LOCK: C15.H2(K2:IN1) D16.V2
MEM_DONE: C17.U2(IN) D13.P1(P1:OUT)
MEM_DONE_NOT: C15.N1(N1:OUT) D13.N1(P1:IN)
MEM_RET [Supply]: A25.B2 A26.B2 B25.B2 B26.B2 B28.L2
MEM_START: C13.U2(V2:IN4) D16.B1(E1:C) ; also sheet 1
MEM_SUPPLY+ [Supply]: A25.J2 A25.U2 A26.E2 A26.J2 A26.U2 B25.E2 B26.H2 B27.M2 B28.M2 B28.N2 B28.P2 B28.R2 ; also sheet 16
MEM_SUPPLY- [Supply]: A25.H2 A26.H2 A26.M2 B25.H2 B25.J2 B25.U2 B26.J2 B26.U2 B27.V2 B28.S2 B28.T2 B28.U2 B28.V2 ; also sheet 13,16
NEG_CLAMP: A26.R2 C25.V2 D25.V2 ; also sheet 17,18
PANEL_LOCK: A28.T2 B01.N2
READ: C17.R2(R) C25.D2 C25.M2 D16.L1 D25.D1 D25.L1
SLICE: A28.V2 ; also sheet 16
STOP_OK: A27.H2 ; also sheet 1,20
STROBE_FIELD0: C17.S2(S) ; also sheet 16
VCC [Supply]: A28.A2 B28.A2 ; also sheet 13,14,19,20
WRITE: C25.D1 C25.L1 D16.S1 D16.S2(V2:C) D25.D2 D25.M2
X_R/W_RETURN: B26.D2 D25.F2 D25.K1 ; also sheet 17
X_R/W_SOURCE: A26.D2 C25.F2 C25.K1 ; also sheet 17
Y_R/W_RETURN: A25.D2 D25.P2 D25.S1 ; also sheet 18
Y_R/W_SOURCE: B25.D2 C25.P2 C25.S1 ; also sheet 18
Unconnected: A25.C2 A25.V2 A26.C2 A26.K2 A26.L2 A26.S2 A26.T2 A26.V2 A27.A2 A27.B2 A27.C2 A27.D2 A27.E2 A27.K2 A27.L2 A27.M2 A27.N2 A27.P2 A27.R2 A27.U2 A27.V2 A28.A1 A28.B1 A28.C1 A28.D1 A28.F1 A28.H1 A28.J1 A28.K1 A28.L1 A28.M1 A28.N1 A28.P1 A28.R1 A28.S1 A28.T1 A28.U1 A28.V1 B22.A2 B22.B2 B22.U2 B22.V2 B25.C2 B25.V2 B26.C2 B26.V2 B27.A2 B27.B2 B27.C2 B27.D2 B27.E2 B27.H2 B27.L2 B27.N2 B27.P2 B27.T2 B27.U2 C25.F1(F1:H) C25.H1(F1:J) C25.H2(H2:H) C25.J1(F1:K) C25.J2(H2:J) C25.K2(H2:K) C25.N1(N1:H) C25.P1(N1:J) C25.R1(N1:K) C25.R2(R2:H) C25.S2(R2:J) C25.T2(R2:K) D14.J2(H2:J2) D14.K2(H2:K2) D14.L2(H2:L2) D14.P2(H2:P2) D14.R2(H2:R2) D14.S2(H2:S2) D14.T2(H2:T2) D14.U2(H2:U2) D14.V2(H2:V2) D15.J2(H2:J2) D15.K2(H2:K2) D15.M2(H2:M2) D15.N2(H2:N2) D15.P2(H2:P2) D15.R2(H2:R2) D15.S2(H2:S2) D15.U2(H2:U2) D15.V2(H2:V2) D16.E1 D16.J2 D16.M1 D16.U1 D17.U1 D25.F1(F1:H) D25.H1(F1:J) D25.H2(H2:H) D25.J1(F1:K) D25.J2(H2:J) D25.K2(H2:K) D25.N1(N1:H) D25.P1(N1:J) D25.R1(N1:K) D25.R2(R2:H) D25.S2(R2:J) D25.T2(R2:K)

### Notes on the sheet
- G785
- AB28
- Power Supply
- Connector and
- Regulator
- Thermistor
- G826
- AB27
- Lamp Power
- Regulator and Power Detector
- Memory Control
- D-BS-8L-0-13

## Sheet 16 of 23
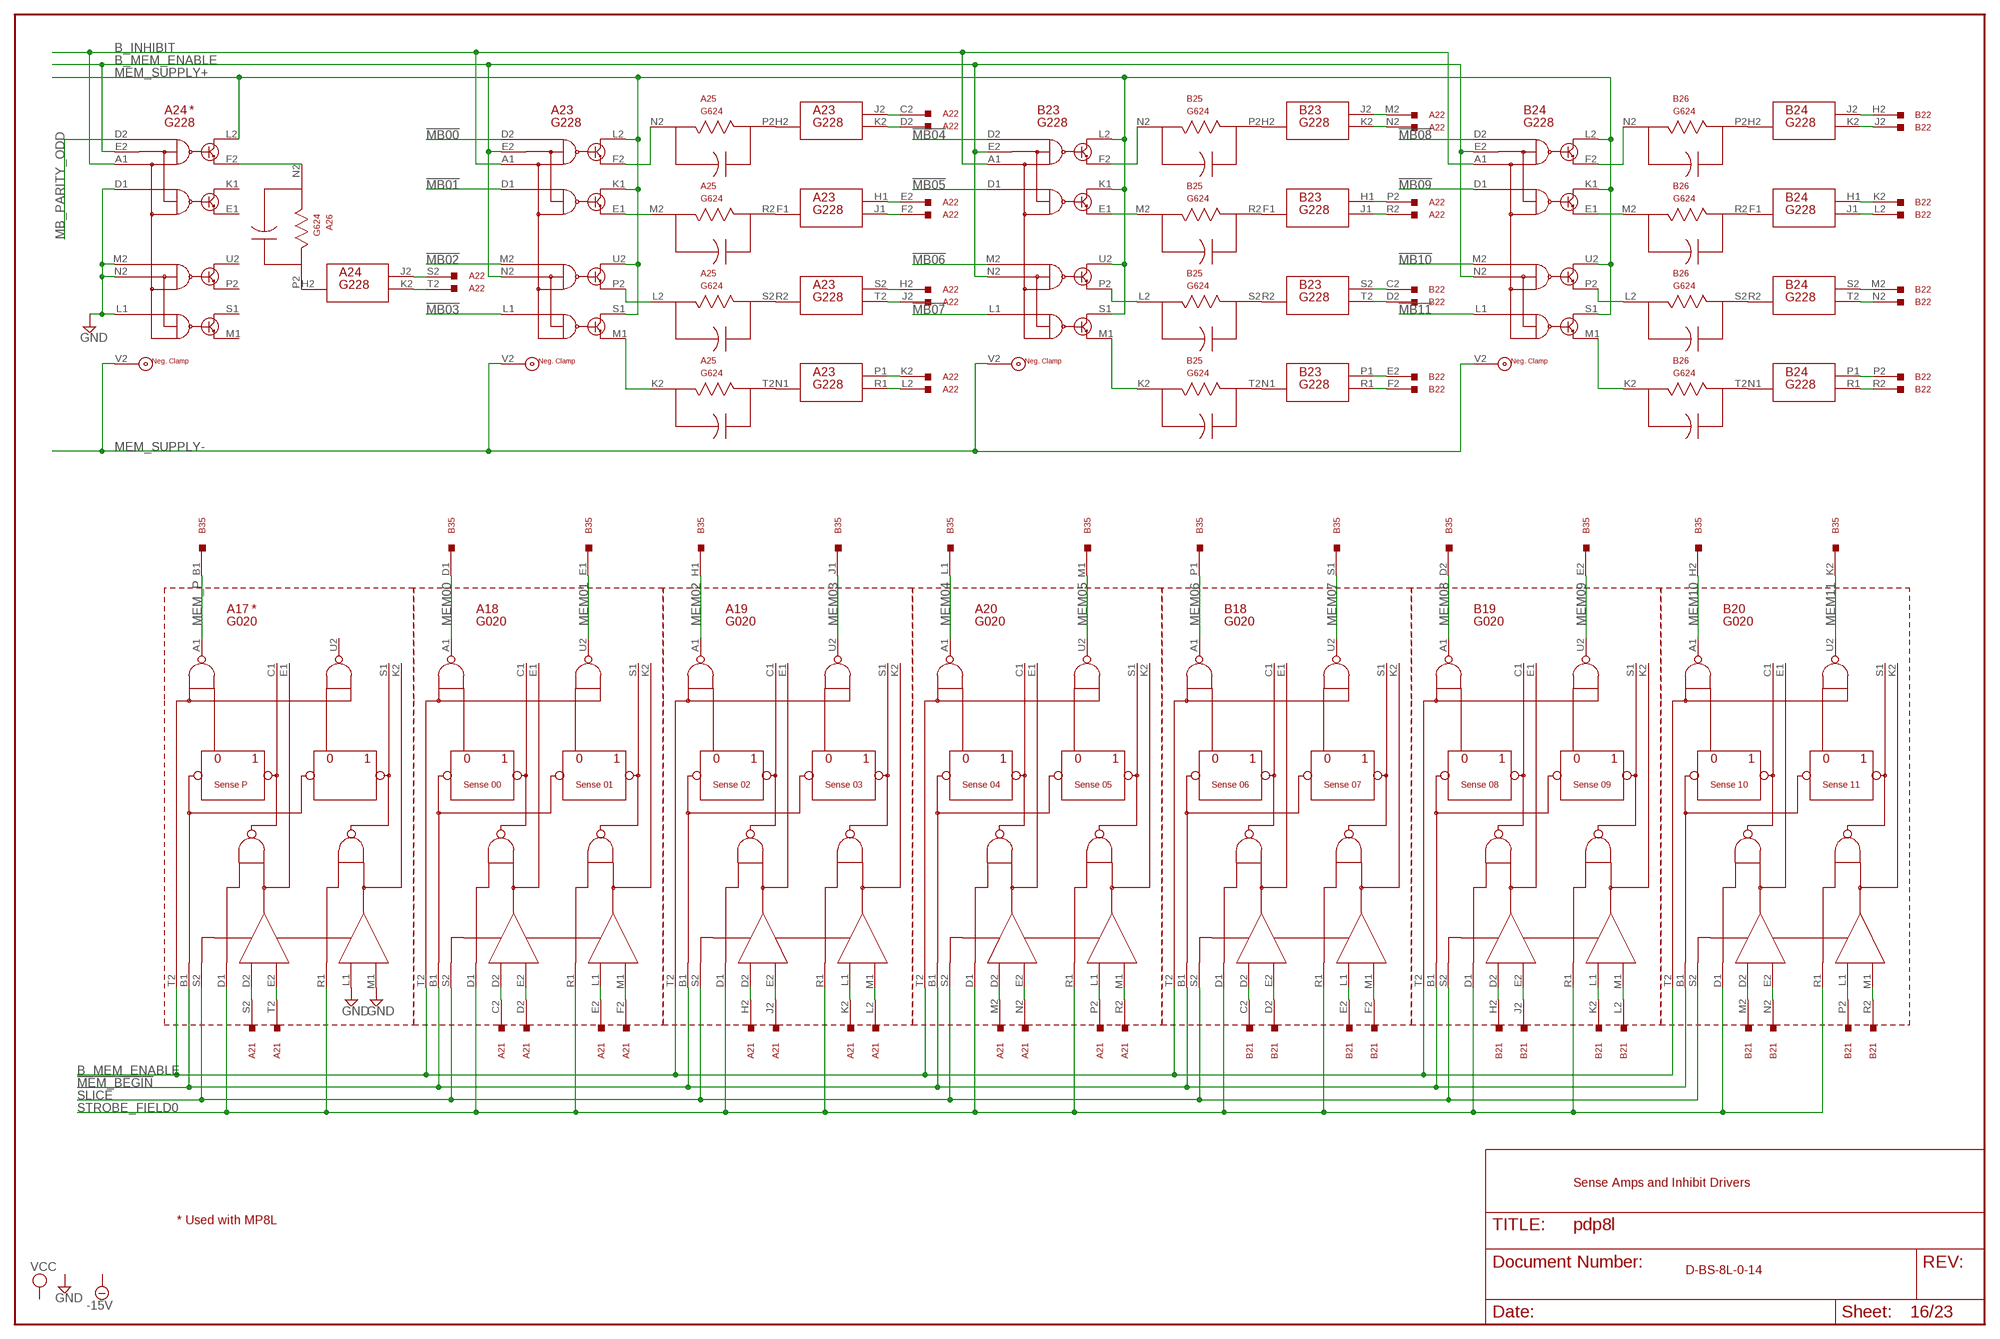
[diagram p15: schematic, sheet 16]

### Parts
A17  G020  [H807]
A18  G020  [H807]
A19  G020  [H807]
A20  G020  [H807]
A21  W025A  W023  [H807]
A22  W025A  W023  [H807]
A23  G228  [H807]
A24  G228  [H807]
B18  G020  [H807]
B19  G020  [H807]
B20  G020  [H807]
B21  W025B  W023  [H807]
B23  G228  [H807]
B24  G228  [H807]

### Nets
!MB00: A23.D2 ; also sheet 7,23
!MB01: A23.D1 ; also sheet 7,23
!MB02: A23.M2 ; also sheet 7,23
!MB03: A23.L1 ; also sheet 2,3,6,7,12,13,14,20,21,22,23
!MB04: B23.D2 ; also sheet 3,6,7,12,13,14,20,21,22,23
!MB05: B23.D1 ; also sheet 3,6,7,12,13,14,21,22,23
!MB06: B23.M2 ; also sheet 3,6,7,12,13,20,21,22,23
!MB07: B23.L1 ; also sheet 3,6,7,12,14,20,22,23
!MB08: B24.D2 ; also sheet 4,5,6,7,12,14,20,21,23
!MB09: B24.D1 ; also sheet 4,7,23
!MB10: B24.M2 ; also sheet 4,6,7,23
!MB11: B24.L1 ; also sheet 1,2,3,6,7,23
!MEM_BEGIN: A17.B1 A18.B1 A19.B1 A20.B1 B18.B1 B19.B1 B20.B1 ; also sheet 15
A21C2: A18.D2 A21.C2
A21D2: A18.E2 A21.D2
A21E2: A18.L1 A21.E2
A21F2: A18.M1 A21.F2
A21H2: A19.D2 A21.H2
A21J2: A19.E2 A21.J2
A21K2: A19.L1 A21.K2
A21L2: A19.M1 A21.L2
A21M2: A20.D2 A21.M2
A21N2: A20.E2 A21.N2
A21P2: A20.L1 A21.P2
A21R2: A20.M1 A21.R2
A21S2: A17.D2 A21.S2
A21T2: A17.E2 A21.T2
A23E1: A23.E1 A25.M2
A23F2: A23.F2 A25.N2
A23H1: A22.E2 A23.H1(F1:J)
A23J1: A22.F2 A23.J1(F1:K)
A23J2: A22.C2 A23.J2(H2:J)
A23K2: A22.D2 A23.K2(H2:K)
A23M1: A23.M1 A25.K2
A23P1: A22.K2 A23.P1(N1:J)
A23P2: A23.P2 A25.L2
A23R1: A22.L2 A23.R1(N1:K)
A23S2: A22.H2 A23.S2(R2:J)
A23T2: A22.J2 A23.T2(R2:K)
A24F2: A24.F2 A26.N2
A24J2: A22.S2 A24.J2(H2:J)
A24K2: A22.T2 A24.K2(H2:K)
A25P2: A23.H2(H2:H) A25.P2
A25R2: A23.F1(F1:H) A25.R2
A25S2: A23.R2(R2:H) A25.S2
A25T2: A23.N1(N1:H) A25.T2
A26P2: A24.H2(H2:H) A26.P2
B21C2: B18.D2 B21.C2
B21D2: B18.E2 B21.D2
B21E2: B18.L1 B21.E2
B21F2: B18.M1 B21.F2
B21H2: B19.D2 B21.H2
B21J2: B19.E2 B21.J2
B21K2: B19.L1 B21.K2
B21L2: B19.M1 B21.L2
B21M2: B20.D2 B21.M2
B21N2: B20.E2 B21.N2
B21P2: B20.L1 B21.P2
B21R2: B20.M1 B21.R2
B23E1: B23.E1 B25.M2
B23F2: B23.F2 B25.N2
B23H1: A22.P2 B23.H1(F1:J)
B23J1: A22.R2 B23.J1(F1:K)
B23J2: A22.M2 B23.J2(H2:J)
B23K2: A22.N2 B23.K2(H2:K)
B23M1: B23.M1 B25.K2
B23P1: B22.E2 B23.P1(N1:J)
B23P2: B23.P2 B25.L2
B23R1: B22.F2 B23.R1(N1:K)
B23S2: B22.C2 B23.S2(R2:J)
B23T2: B22.D2 B23.T2(R2:K)
B24E1: B24.E1 B26.M2
B24F2: B24.F2 B26.N2
B24H1: B22.K2 B24.H1(F1:J)
B24J1: B22.L2 B24.J1(F1:K)
B24J2: B22.H2 B24.J2(H2:J)
B24K2: B22.J2 B24.K2(H2:K)
B24M1: B24.M1 B26.K2
B24P1: B22.P2 B24.P1(N1:J)
B24P2: B24.P2 B26.L2
B24R1: B22.R2 B24.R1(N1:K)
B24S2: B22.M2 B24.S2(R2:J)
B24T2: B22.N2 B24.T2(R2:K)
B25P2: B23.H2(H2:H) B25.P2
B25R2: B23.F1(F1:H) B25.R2
B25S2: B23.R2(R2:H) B25.S2
B25T2: B23.N1(N1:H) B25.T2
B26P2: B24.H2(H2:H) B26.P2
B26R2: B24.F1(F1:H) B26.R2
B26S2: B24.R2(R2:H) B26.S2
B26T2: B24.N1(N1:H) B26.T2
B_INHIBIT: A23.A1 A24.A1 B23.A1 B24.A1 ; also sheet 15
B_MEM_ENABLE: A17.T2 A18.T2 A19.T2 A20.T2 A23.E2 A23.N2 A24.E2 B18.T2 B19.T2 B20.T2 B23.E2 B23.N2 B24.E2 B24.N2 ; also sheet 15,17,18
GND [Supply]: A17.L1 A17.M1 A24.D1 A24.L1 A24.M2 A24.N2 ; also sheet 1,3,8,9,10,11,12,13,14,15,19,20,21,23
MB_PARITY_ODD: A24.D2 ; also sheet 23
MEM00: A18.A1 B35.D1 ; also sheet 2,8,23
MEM01: A18.U2 B35.E1 ; also sheet 2,8,23
MEM02: A19.A1 B35.H1 ; also sheet 2,8,23
MEM03: A19.U2 B35.J1 ; also sheet 9,23
MEM04: A20.A1 B35.L1 ; also sheet 9,23
MEM05: A20.U2 B35.M1 ; also sheet 9,23
MEM06: B18.A1 B35.P1 ; also sheet 10,23
MEM07: B18.U2 B35.S1 ; also sheet 10,23
MEM08: B19.A1 B35.D2 ; also sheet 10,23
MEM09: B19.U2 B35.E2 ; also sheet 11,23
MEM10: B20.A1 B35.H2 ; also sheet 11,23
MEM11: B20.U2 B35.K2 ; also sheet 11,23
MEM_P: A17.A1 B35.B1 ; also sheet 23
MEM_SUPPLY+ [Supply]: A23.K1 A23.L2 A23.S1 A23.U2 A24.L2 B23.K1 B23.L2 B23.S1 B23.U2 B24.K1 B24.L2 B24.S1 B24.U2 ; also sheet 15
MEM_SUPPLY- [Supply]: A23.V2 A24.V2 B23.V2 B24.V2 ; also sheet 13,15
SLICE: A17.S2 A18.S2 A19.S2 A20.S2 B18.S2 B19.S2 B20.S2 ; also sheet 15
STROBE_FIELD0: A17.D1 A17.R1 A18.D1 A18.R1 A19.D1 A19.R1 A20.D1 A20.R1 B18.D1 B18.R1 B19.D1 B19.R1 B20.D1 B20.R1 ; also sheet 15
Unconnected: A17.C1 A17.E1 A17.K2 A17.S1 A17.U2 A18.C1 A18.E1 A18.K2 A18.S1 A19.C1 A19.E1 A19.K2 A19.S1 A20.C1 A20.E1 A20.K2 A20.S1 A21.A2 A21.B2 A21.U2 A21.V2 A22.A2 A22.B2 A22.U2 A22.V2 A24.E1 A24.F1(F1:H) A24.H1(F1:J) A24.J1(F1:K) A24.K1 A24.M1 A24.N1(N1:H) A24.P1(N1:J) A24.P2 A24.R1(N1:K) A24.R2(R2:H) A24.S1 A24.S2(R2:J) A24.T2(R2:K) A24.U2 B18.C1 B18.E1 B18.K2 B18.S1 B19.C1 B19.E1 B19.K2 B19.S1 B20.C1 B20.E1 B20.K2 B20.S1 B21.A2 B21.B2 B21.S2 B21.T2 B21.U2 B21.V2

### Notes on the sheet
- *
- *
- Sense P | Sense 00 | Sense 01 | Sense 02 | Sense 03 | Sense 04 | Sense 05 | Sense 06 | Sense 07 | Sense 08 | Sense 09 | Sense 10 | Sense 11
- Sense Amps and Inhibit Drivers
- * Used with MP8L
- D-BS-8L-0-14

## Sheet 17 of 23
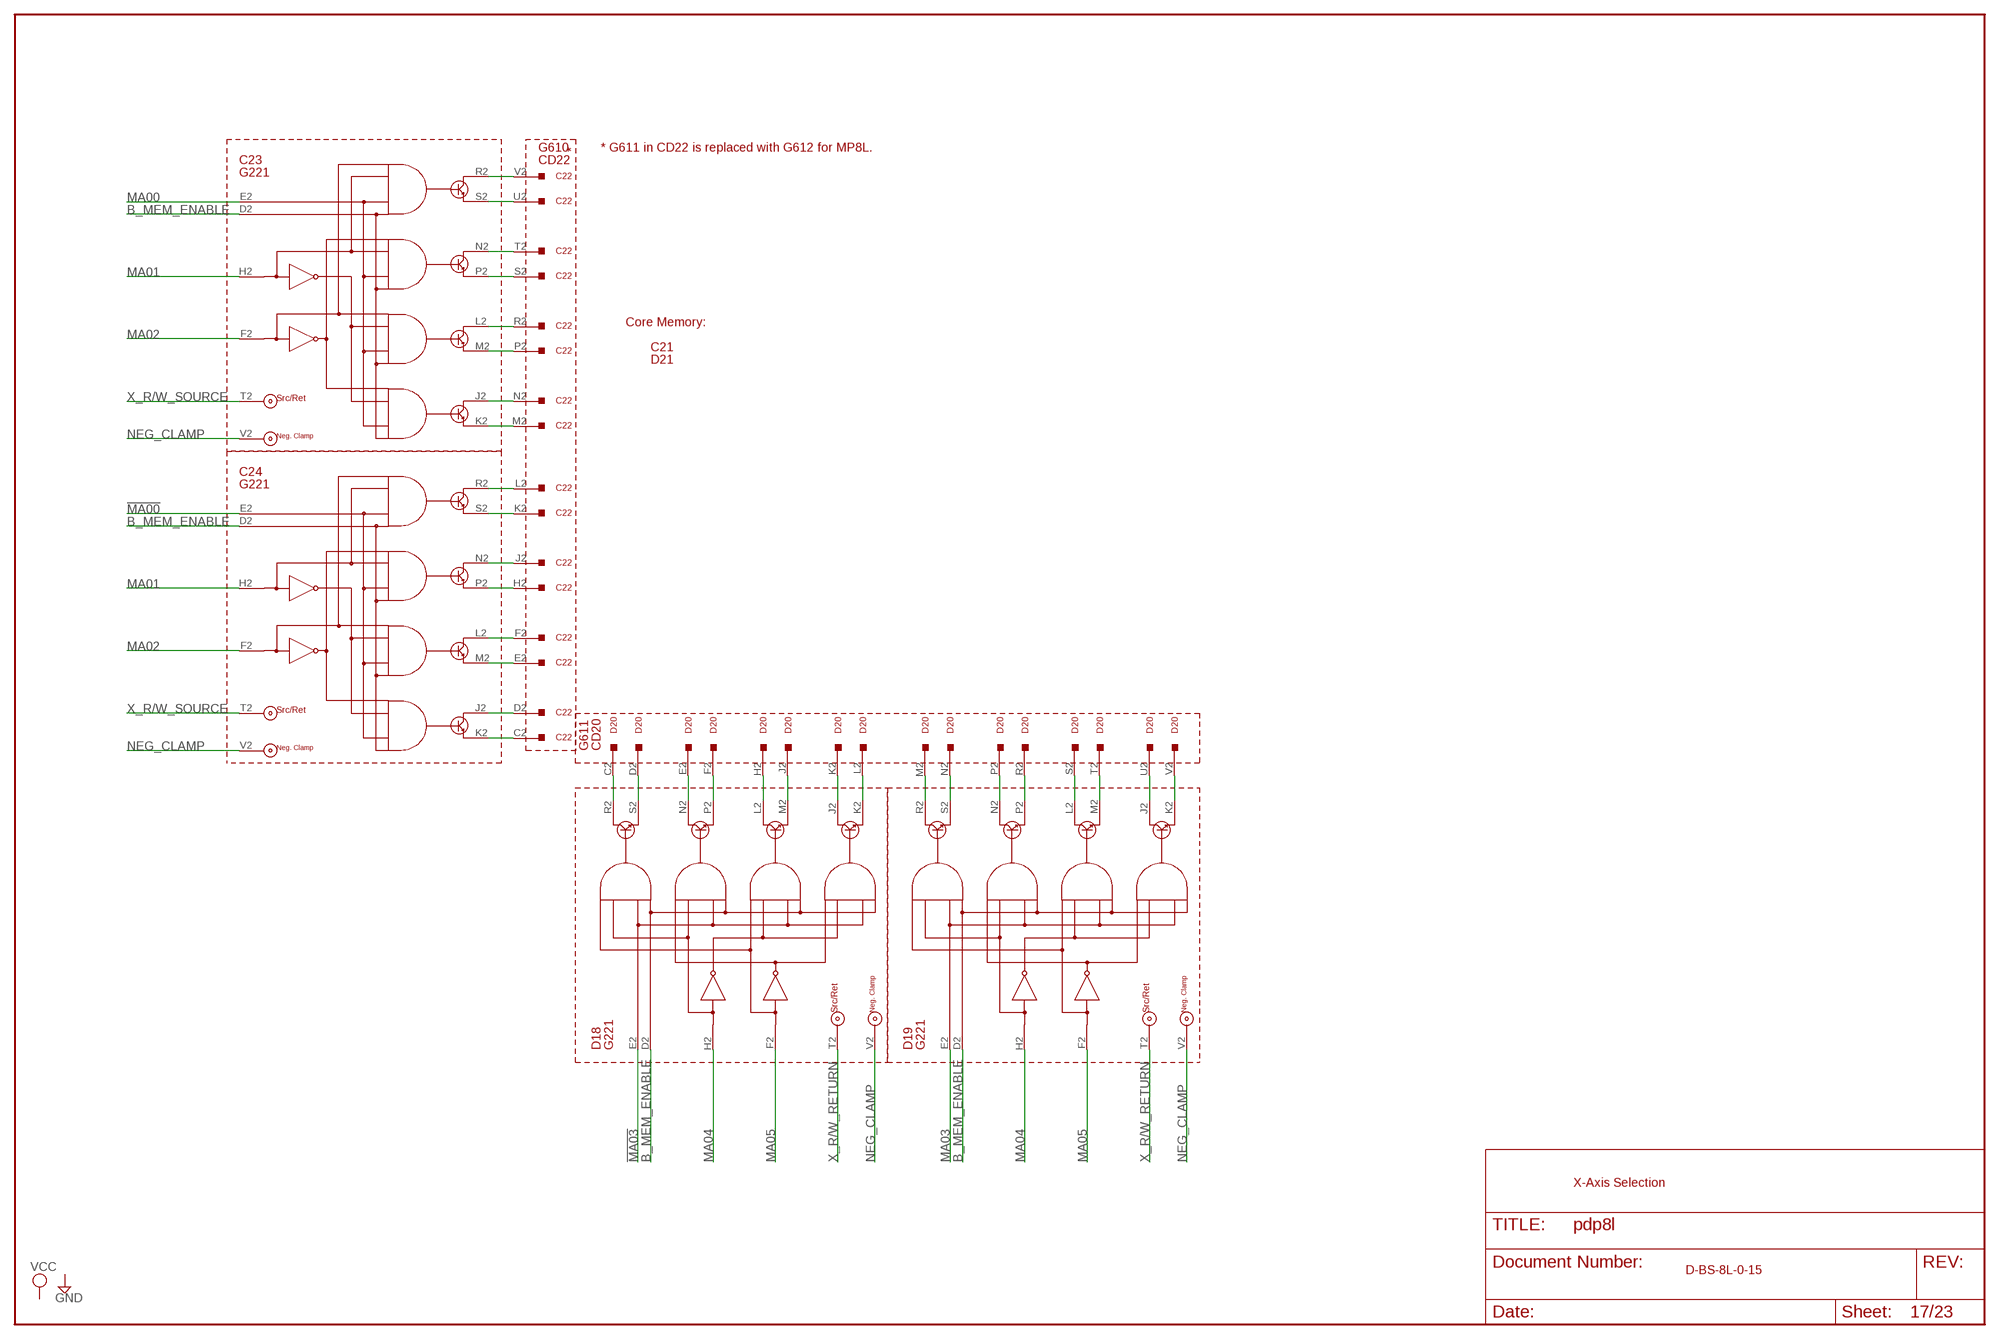
[diagram p16: schematic, sheet 17]

### Parts
C21  H807  [H807]
C22  G610A  W023  [H807]
C23  G221  [H807]
C24  G221  [H807]
D18  G221  [H807]
D19  G221  [H807]
D20  G611B  W023  [H807]
D21  H807  [H807]

### Nets
!MA00: C24.E2 ; also sheet 4,7,19
!MA03: D18.E2 ; also sheet 4,7,19
B_MEM_ENABLE: C23.D2 C24.D2 D18.D2 D19.D2 ; also sheet 15,16,18
C23J2: C22.N2 C23.J2
C23K2: C22.M2 C23.K2
C23L2: C22.R2 C23.L2
C23M2: C22.P2 C23.M2
C23N2: C22.T2 C23.N2
C23P2: C22.S2 C23.P2
C23R2: C22.V2 C23.R2
C23S2: C22.U2 C23.S2
C24J2: C22.D2 C24.J2
C24K2: C22.C2 C24.K2
C24M2: C22.E2 C24.M2
C24N2: C22.J2 C24.N2
C24P2: C22.H2 C24.P2
C24R2: C22.L2 C24.R2
C24S2: C22.K2 C24.S2
D18J2: D18.J2 D20.K2
D18K2: D18.K2 D20.L2
D18L2: D18.L2 D20.H2
D18M2: D18.M2 D20.J2
D18N2: D18.N2 D20.E2
D18P2: D18.P2 D20.F2
D18R2: D18.R2 D20.C2
D18S2: D18.S2 D20.D2
D19J2: D19.J2 D20.U2
D19K2: D19.K2 D20.V2
D19L2: D19.L2 D20.S2
D19M2: D19.M2 D20.T2
D19N2: D19.N2 D20.P2
D19P2: D19.P2 D20.R2
D19R2: D19.R2 D20.M2
D19S2: D19.S2 D20.N2
MA00: C23.E2 ; also sheet 2,7
MA01: C23.H2 C24.H2 ; also sheet 2,7
MA02: C23.F2 C24.F2 ; also sheet 2,7
MA03: D19.E2 ; also sheet 2,7
MA04: D18.H2 D19.H2 ; also sheet 2,7
MA05: D18.F2 D19.F2 ; also sheet 7
NEG_CLAMP: C23.V2 C24.V2 D18.V2 D19.V2 ; also sheet 15,18
V24L2: C22.F2 C24.L2
X_R/W_RETURN: D18.T2 D19.T2 ; also sheet 15
X_R/W_SOURCE: C23.T2 C24.T2 ; also sheet 15
Unconnected: C22.A2 C22.B2 D20.A2 D20.B2

### Notes on the sheet
- G610 | * | * G611 in CD22 is replaced with G612 for MP8L.
- CD22
- Core Memory:
- G611 | CD20
- X-Axis Selection
- D-BS-8L-0-15

## Sheet 18 of 23
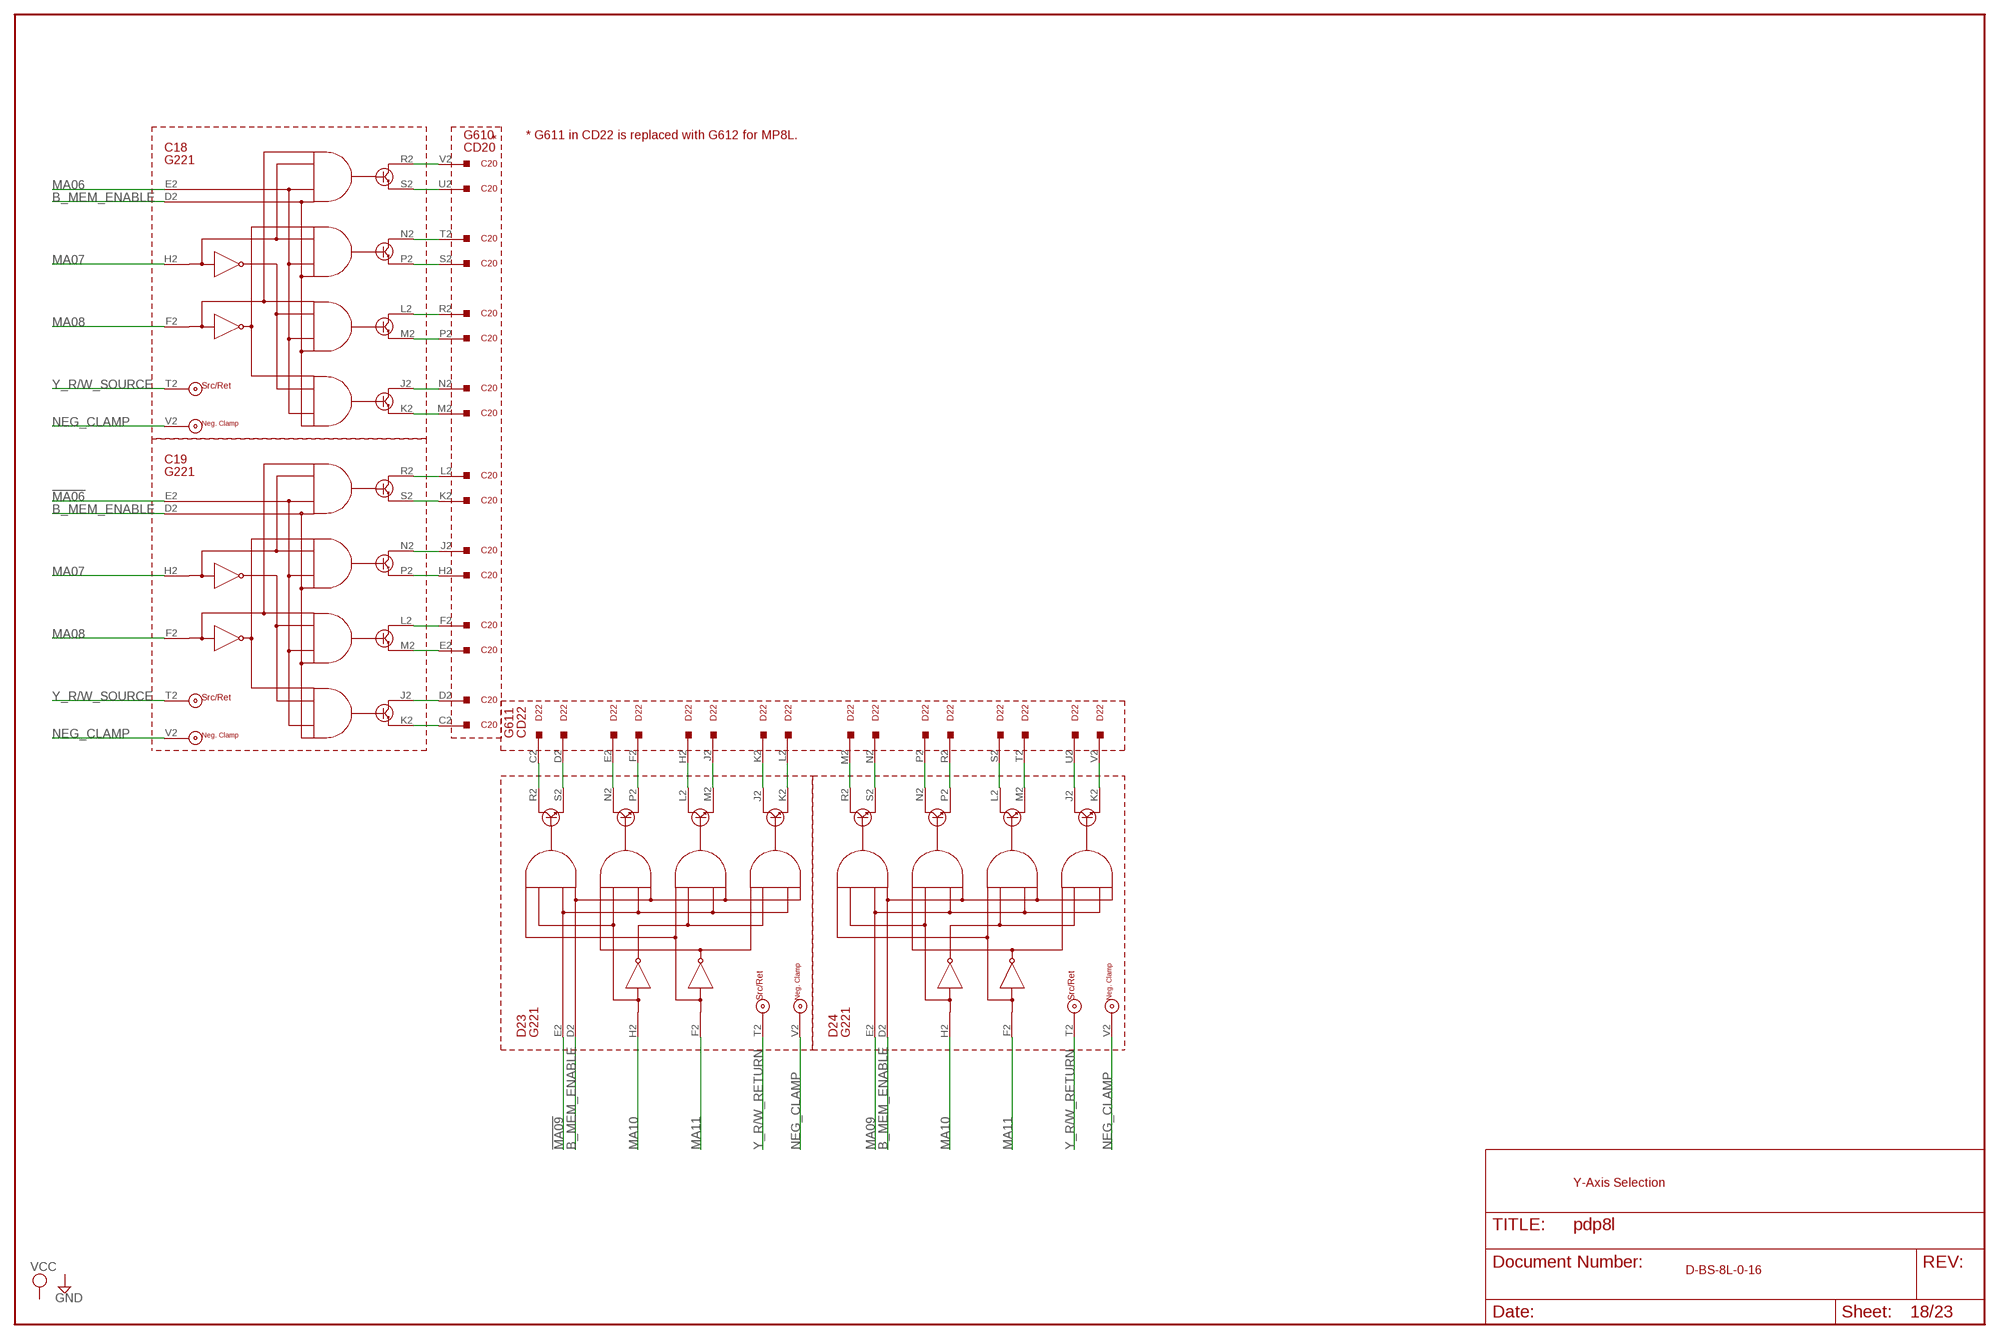
[diagram p17: schematic, sheet 18]

### Parts
C18  G221  [H807]
C19  G221  [H807]
C20  G610A  W023  [H807]
D22  G611B  W023  [H807]
D23  G221  [H807]
D24  G221  [H807]

### Nets
!MA06: C19.E2 ; also sheet 4,7,19
!MA09: D23.E2 ; also sheet 7,19
B_MEM_ENABLE: C18.D2 C19.D2 D23.D2 D24.D2 ; also sheet 15,16,17
C18J2: C18.J2 C20.N2
C18K2: C18.K2 C20.M2
C18L2: C18.L2 C20.R2
C18M2: C18.M2 C20.P2
C18N2: C18.N2 C20.T2
C18P2: C18.P2 C20.S2
C18R2: C18.R2 C20.V2
C18S2: C18.S2 C20.U2
C19J2: C19.J2 C20.D2
C19K2: C19.K2 C20.C2
C19L2: C19.L2 C20.F2
C19M2: C19.M2 C20.E2
C19N2: C19.N2 C20.J2
C19P2: C19.P2 C20.H2
C19R2: C19.R2 C20.L2
C19S2: C19.S2 C20.K2
D23J2: D22.K2 D23.J2
D23K2: D22.L2 D23.K2
D23L2: D22.H2 D23.L2
D23M2: D22.J2 D23.M2
D23N2: D22.E2 D23.N2
D23P2: D22.F2 D23.P2
D23R2: D22.C2 D23.R2
D23S2: D22.D2 D23.S2
D24J2: D22.U2 D24.J2
D24K2: D22.V2 D24.K2
D24L2: D22.S2 D24.L2
D24M2: D22.T2 D24.M2
D24N2: D22.P2 D24.N2
D24P2: D22.R2 D24.P2
D24R2: D22.M2 D24.R2
D24S2: D22.N2 D24.S2
MA06: C18.E2 ; also sheet 7
MA07: C18.H2 C19.H2 ; also sheet 7
MA08: C18.F2 C19.F2 ; also sheet 4,7
MA09: D24.E2 ; also sheet 7
MA10: D23.H2 D24.H2 ; also sheet 7
MA11: D23.F2 D24.F2 ; also sheet 7
NEG_CLAMP: C18.V2 C19.V2 D23.V2 D24.V2 ; also sheet 15,17
Y_R/W_RETURN: D23.T2 D24.T2 ; also sheet 15
Y_R/W_SOURCE: C18.T2 C19.T2 ; also sheet 15
Unconnected: C20.A2 C20.B2 D22.A2 D22.B2

### Notes on the sheet
- G610 | * | * G611 in CD22 is replaced with G612 for MP8L.
- CD20
- G611 | CD22
- Y-Axis Selection
- D-BS-8L-0-16

## Sheet 19 of 23
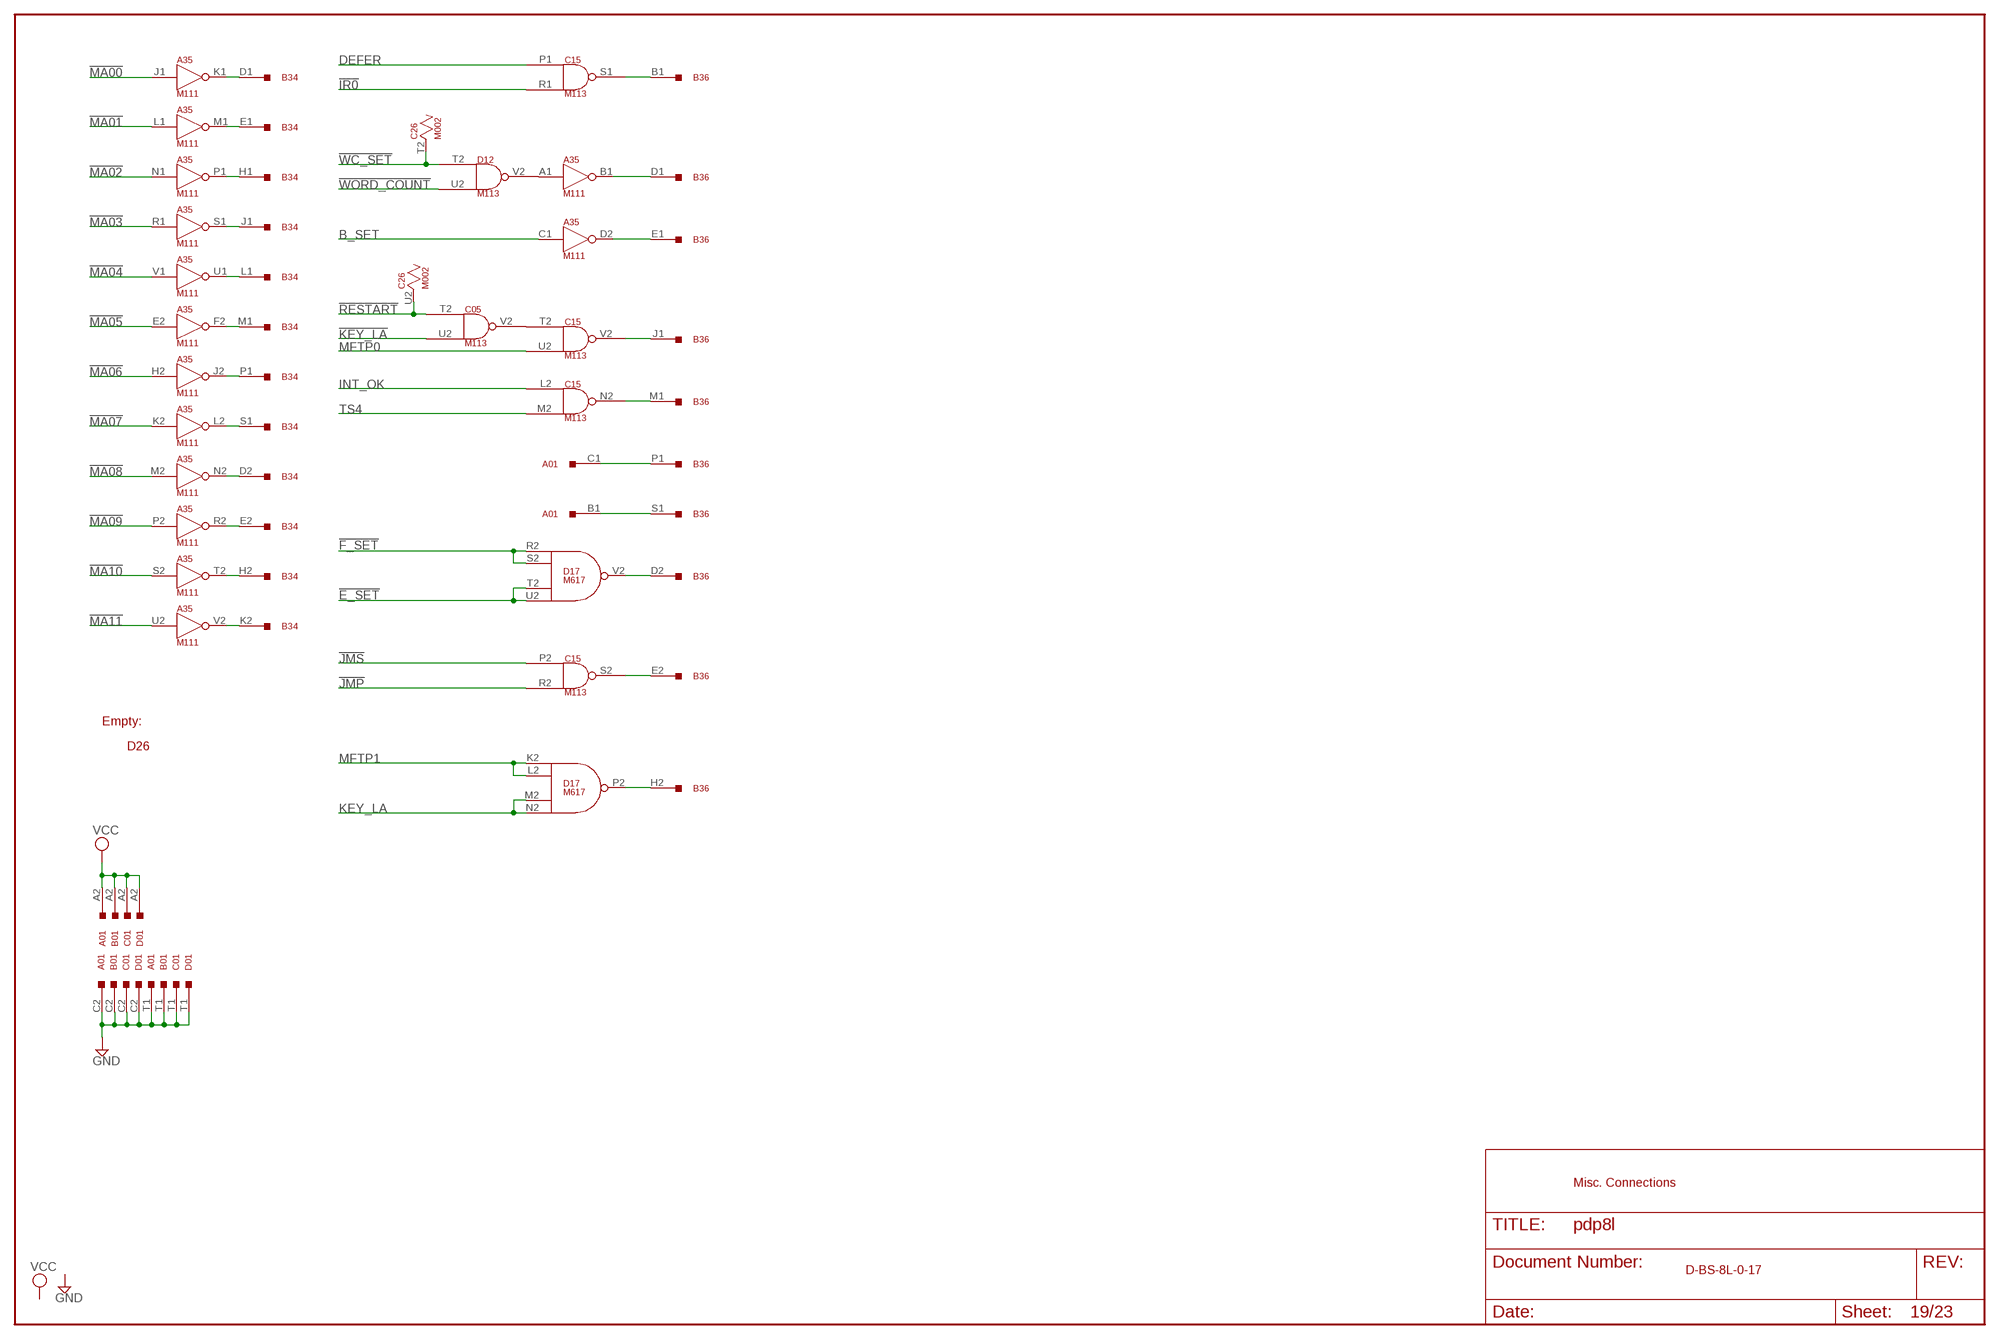
[diagram p18: schematic, sheet 19]

### Parts
D26  H807  [H807]

### Nets
!E_SET: D17.T2(V2:IN3) D17.U2(V2:IN4) ; also sheet 2,3
!F_SET: D17.R2(V2:IN1) D17.S2(V2:IN2) ; also sheet 2
!IR0: C15.R1(S1:IN2) ; also sheet 2
!JMP: C15.R2(S2:IN2) ; also sheet 2,3
!JMS: C15.P2(S2:IN1) ; also sheet 2
!KEY_LA: C05.U2(V2:IN2) ; also sheet 1
!MA00: A35.J1(K1:IN) ; also sheet 4,7,17
!MA01: A35.L1(M1:IN) ; also sheet 4,7
!MA02: A35.N1(P1:IN) ; also sheet 4,7
!MA03: A35.R1(S1:IN) ; also sheet 4,7,17
!MA04: A35.V1(U1:IN) ; also sheet 4,7
!MA05: A35.E2(F2:IN) ; also sheet 4,7
!MA06: A35.H2(J2:IN) ; also sheet 4,7,18
!MA07: A35.K2(L2:IN) ; also sheet 4,7
!MA08: A35.M2(N2:IN) ; also sheet 7
!MA09: A35.P2(R2:IN) ; also sheet 7,18
!MA10: A35.S2(T2:IN) ; also sheet 7
!MA11: A35.U2(V2:IN) ; also sheet 7
!RESTART: C05.T2(V2:IN1) C26.U2 ; also sheet 1,3,20
!WC_SET: C26.T2 D12.T2(V2:IN1) ; also sheet 2
!WORD_COUNT: D12.U2(V2:IN2) ; also sheet 2,4,6
B36B1: B36.B1 C15.S1(S1:OUT)
B36D1: A35.B1(B1:OUT) B36.D1
B36D2: B36.D2 D17.V2(V2:OUT)
B36E1: A35.D2(D2:OUT) B36.E1
B36E2: B36.E2 C15.S2(S2:OUT)
B36H2: B36.H2 D17.P2(P2:OUT)
B36J1: B36.J1 C15.V2(V2:OUT)
B36M1: B36.M1 C15.N2(N2:OUT)
B36P1: A01.C1 B36.P1
B36S1: A01.B1 B36.S1
B_SET: A35.C1(D2:IN) ; also sheet 2
C05V2: C05.V2(V2:OUT) C15.T2(V2:IN1)
D12V2: A35.A1(B1:IN) D12.V2(V2:OUT)
DEFER: C15.P1(S1:IN1) ; also sheet 2,3,4,5
GND [Supply]: A01.C2 A01.T1 B01.C2 B01.T1 C01.C2 C01.T1 D01.C2 D01.T1 ; also sheet 1,3,8,9,10,11,12,13,14,15,16,20,21,23
INT_OK: C15.L2(N2:IN1) ; also sheet 2,6
KEY_LA: D17.M2(P2:IN3) D17.N2(P2:IN4) ; also sheet 1,3
MFTP0: C15.U2(V2:IN2) ; also sheet 1
MFTP1: D17.K2(P2:IN1) D17.L2(P2:IN2) ; also sheet 1,5
MMA00: A35.K1(K1:OUT) B34.D1
MMA01: A35.M1(M1:OUT) B34.E1
MMA02: A35.P1(P1:OUT) B34.H1
MMA03: A35.S1(S1:OUT) B34.J1
MMA04: A35.U1(U1:OUT) B34.L1
MMA05: A35.F2(F2:OUT) B34.M1
MMA06: A35.J2(J2:OUT) B34.P1
MMA07: A35.L2(L2:OUT) B34.S1
MMA08: A35.N2(N2:OUT) B34.D2
MMA09: A35.R2(R2:OUT) B34.E2
MMA10: A35.T2(T2:OUT) B34.H2
MMA11: A35.V2(V2:OUT) B34.K2
TS4: C15.M2(N2:IN2) ; also sheet 1,3
VCC [Supply]: A01.A2 B01.A2 C01.A2 D01.A2 ; also sheet 13,14,15,20

### Notes on the sheet
- Empty:
- Misc. Connections
- D-BS-8L-0-17

## Sheet 20 of 23
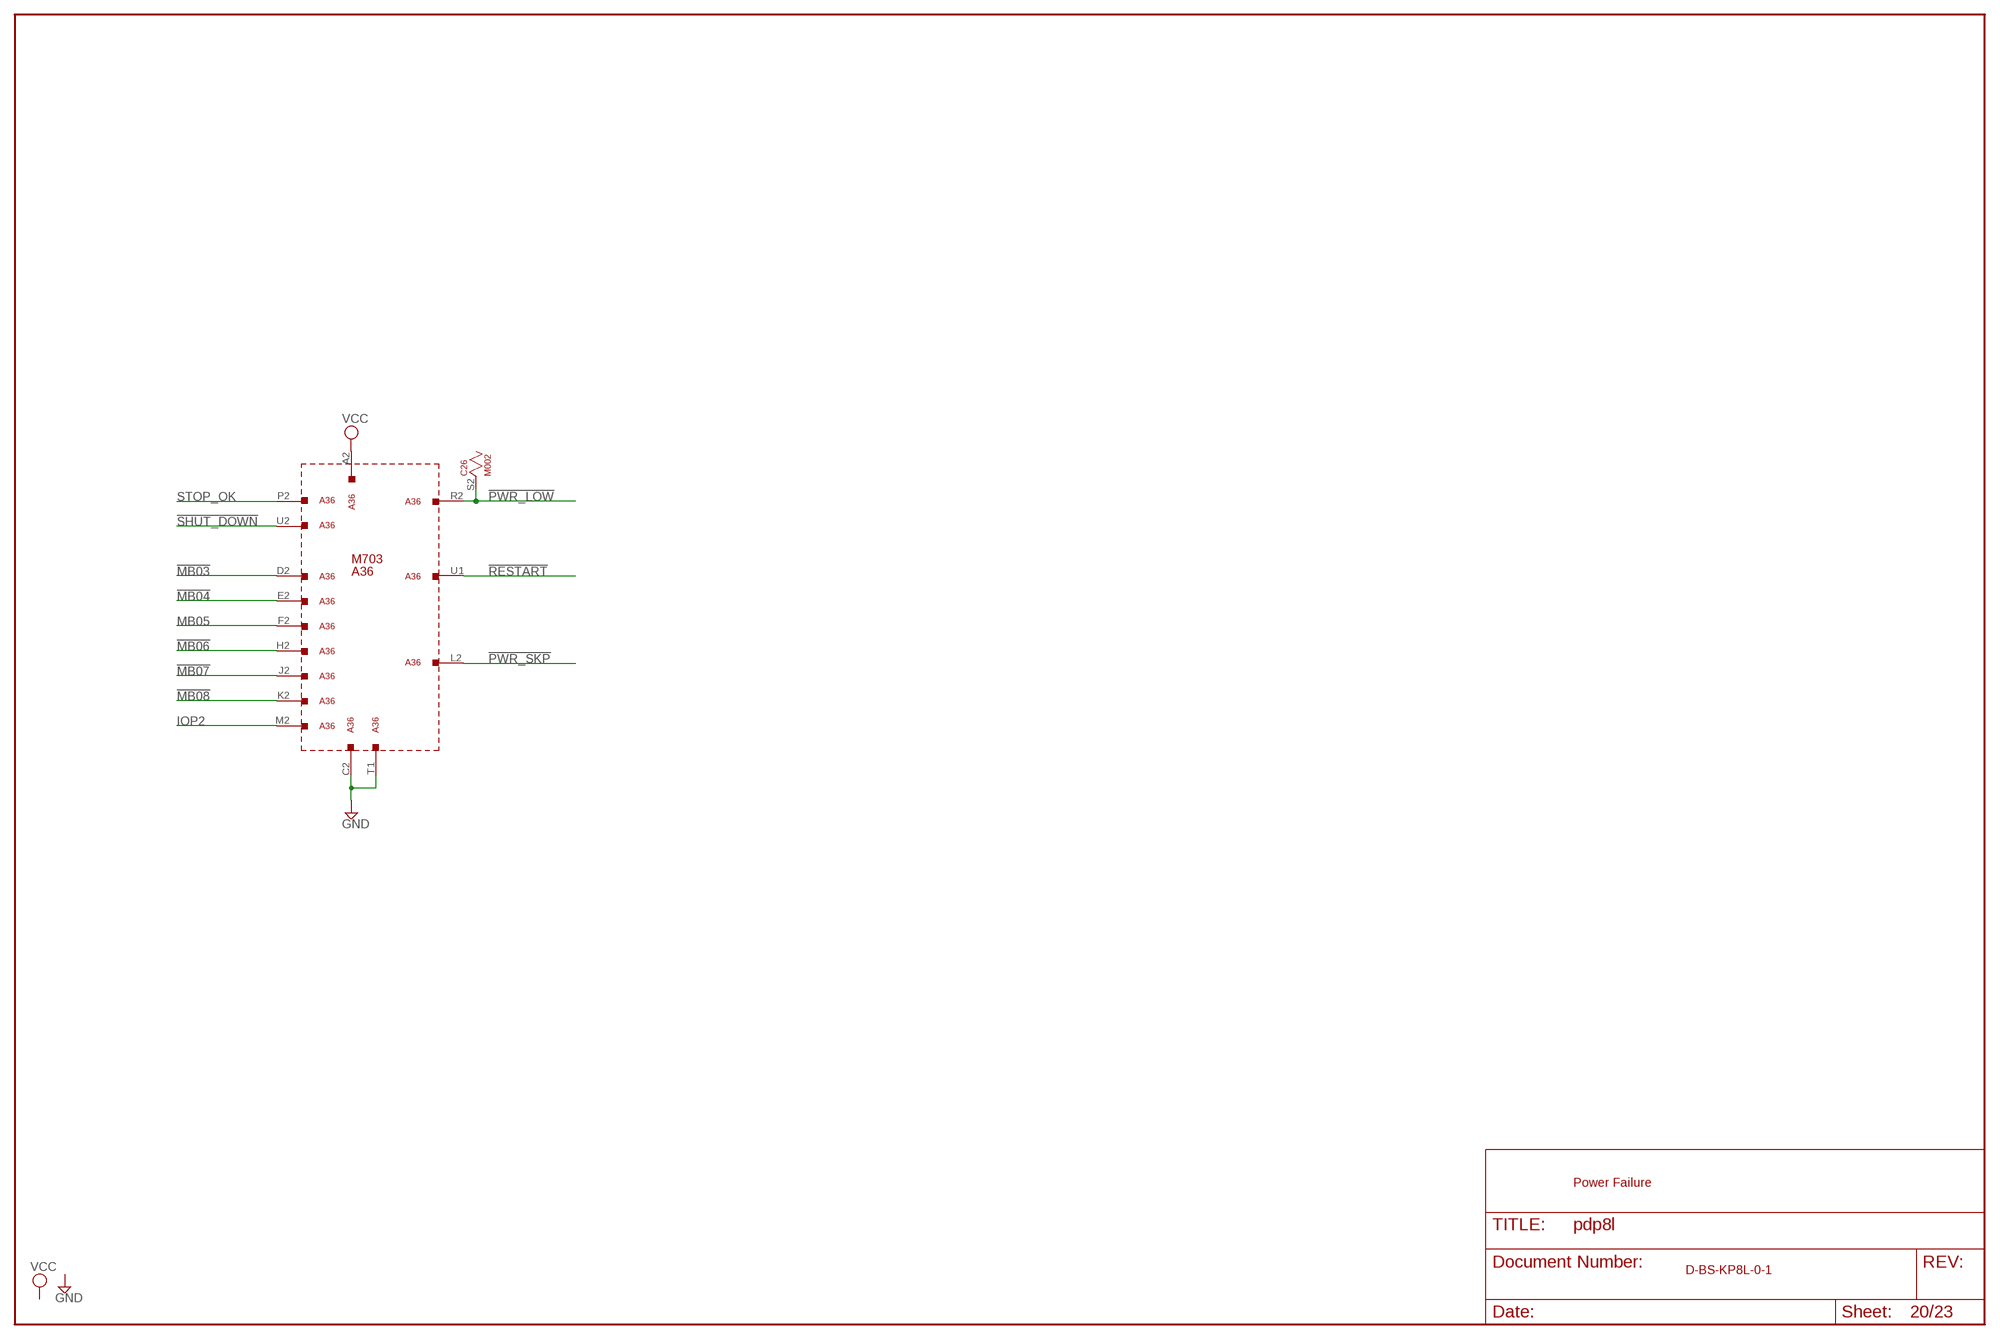
[diagram p19: schematic, sheet 20]

### Parts
A36  M703  M916  [H807]

### Nets
!MB03: A36.D2 ; also sheet 2,3,6,7,12,13,14,16,21,22,23
!MB04: A36.E2 ; also sheet 3,6,7,12,13,14,16,21,22,23
!MB06: A36.H2 ; also sheet 3,6,7,12,13,16,21,22,23
!MB07: A36.J2 ; also sheet 3,6,7,12,14,16,22,23
!MB08: A36.K2 ; also sheet 4,5,6,7,12,14,16,21,23
!PWR_LOW: A36.R2 C26.S2 ; also sheet 12
!PWR_SKP: A36.L2 ; also sheet 12
!RESTART: A36.U1 ; also sheet 1,3,19
!SHUT_DOWN: A36.U2 ; also sheet 15
GND [Supply]: A36.C2 A36.T1 ; also sheet 1,3,8,9,10,11,12,13,14,15,16,19,21,23
IOP2: A36.M2 ; also sheet 1,13,14,21,22
MB05: A36.F2 ; also sheet 3,5,7,12,23
STOP_OK: A36.P2 ; also sheet 1,15
VCC [Supply]: A36.A2 ; also sheet 13,14,15,19
Unconnected: A36.A1 A36.B1 A36.B2 A36.C1 A36.D1 A36.E1 A36.F1 A36.H1 A36.J1 A36.K1 A36.L1 A36.M1 A36.N1 A36.N2 A36.P1 A36.R1 A36.S1 A36.S2 A36.T2 A36.V1 A36.V2

### Notes on the sheet
- M703
- A36
- Power Failure
- D-BS-KP8L-0-1

## Sheet 21 of 23
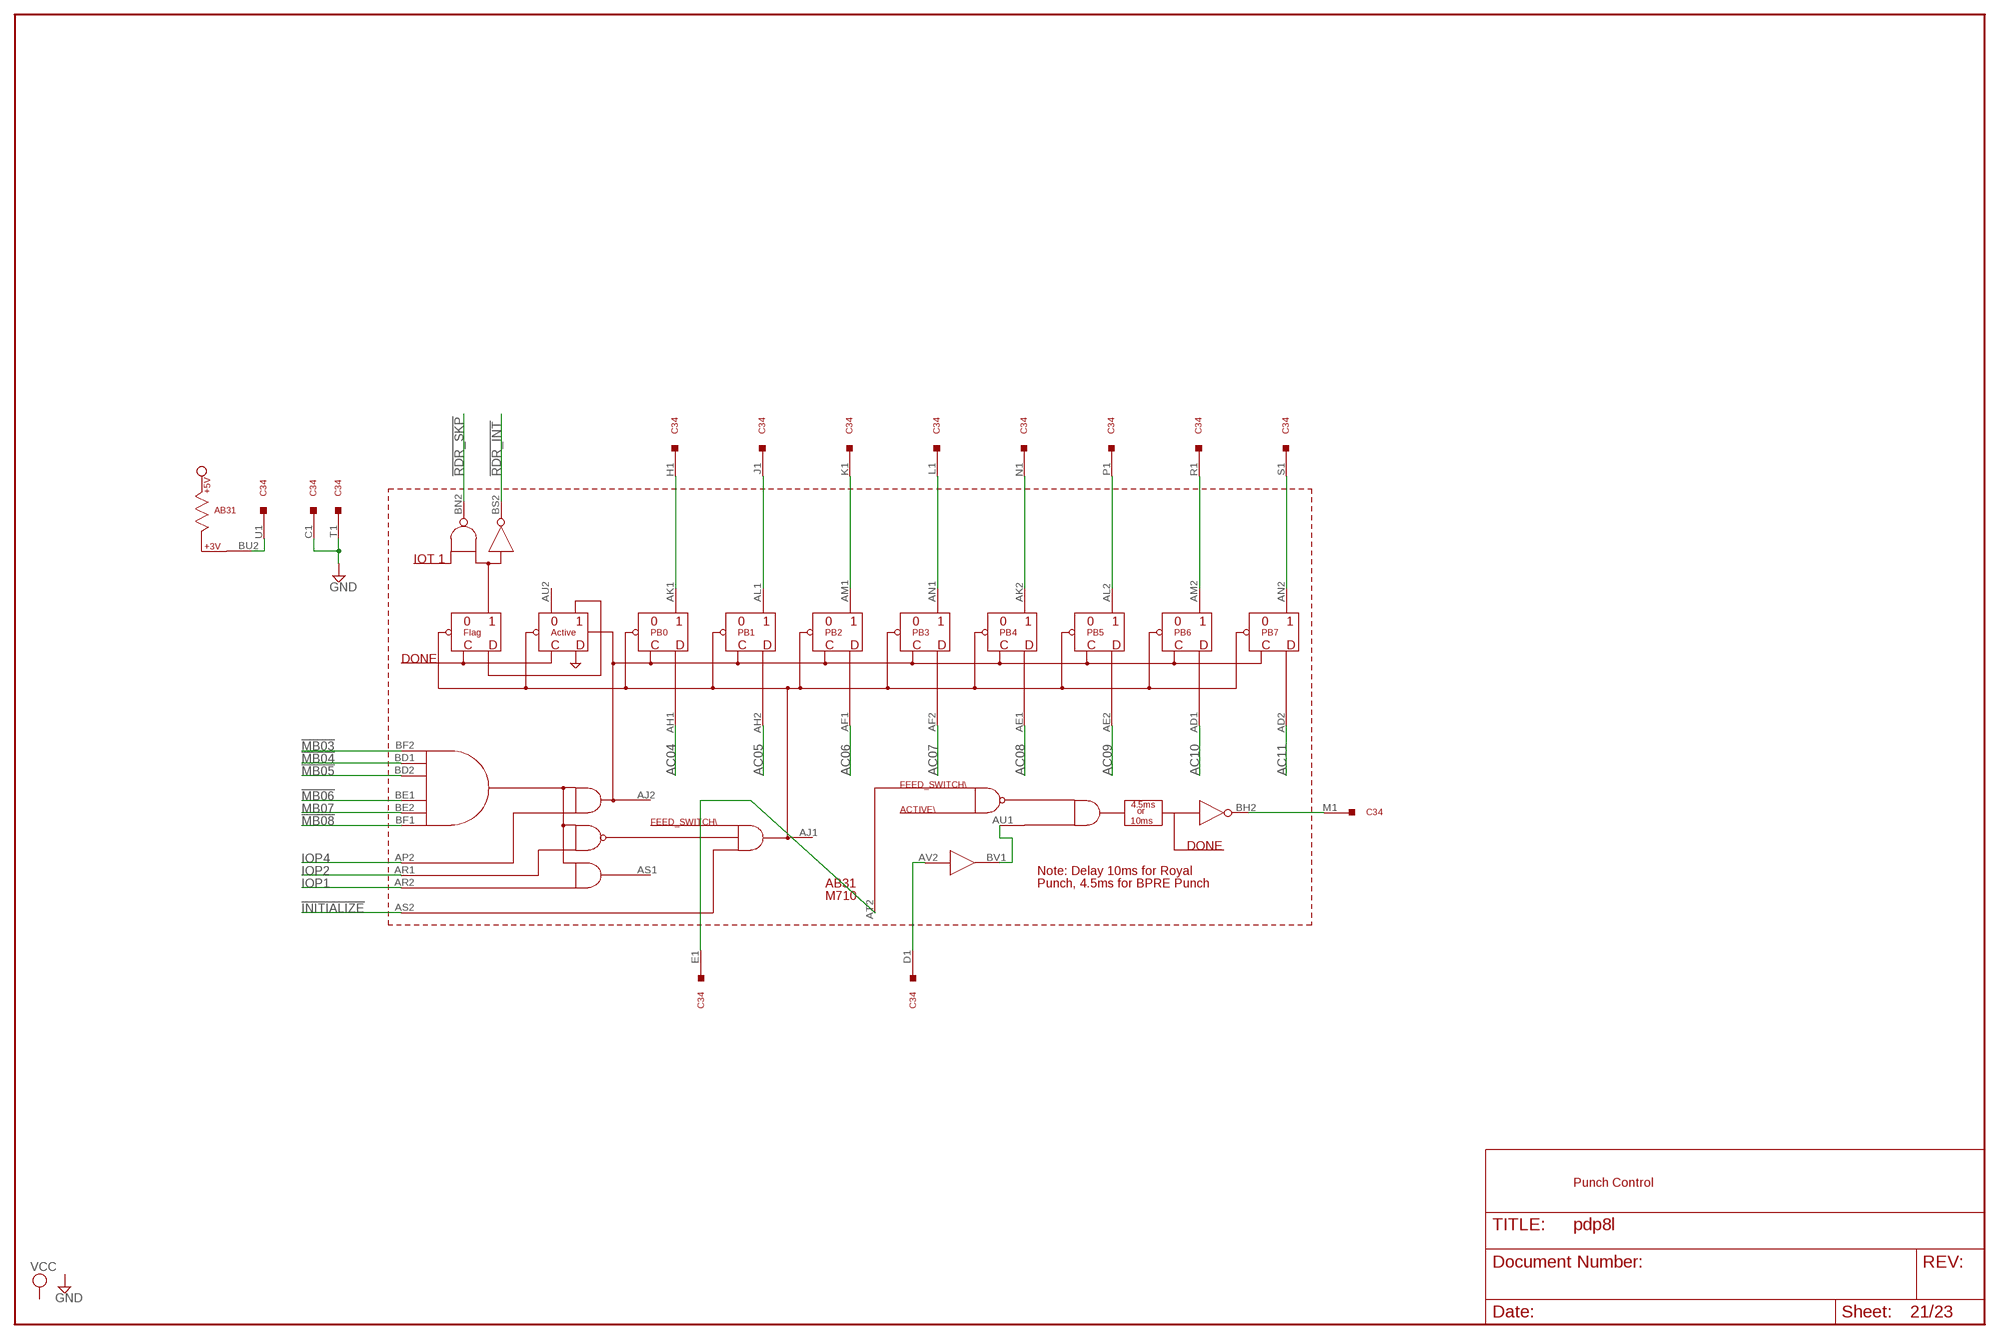
[diagram p20: schematic, sheet 21]

### Parts
AB31  M710  [H807-2]
C34  M916  [H807]

### Nets
!INITIALIZE: AB31.AS2 ; also sheet 1,12,22
!MB03: AB31.BF2 ; also sheet 2,3,6,7,12,13,14,16,20,22,23
!MB04: AB31.BD1 ; also sheet 3,6,7,12,13,14,16,20,22,23
!MB05: AB31.BD2 ; also sheet 3,6,7,12,13,14,16,22,23
!MB06: AB31.BE1 ; also sheet 3,6,7,12,13,16,20,22,23
!MB08: AB31.BF1 ; also sheet 4,5,6,7,12,14,16,20,23
!RDR_DONE: AB31.BH2 C34.M1
!RDR_INT: AB31.BS2 ; also sheet 12,22
!RDR_SKP: AB31.BN2 ; also sheet 12,22
AC04: AB31.AH1 ; also sheet 7,12,14
AC05: AB31.AH2 ; also sheet 7,12,14
AC06: AB31.AF1 ; also sheet 7,12,14
AC07: AB31.AF2 ; also sheet 7,12,14
AC08: AB31.AE1 ; also sheet 7,12,14
AC09: AB31.AE2 ; also sheet 7,12,14
AC10: AB31.AD1 ; also sheet 7,12,14
AC11: AB31.AD2 ; also sheet 7,12,14
B31U2: AB31.BU2 C34.U1
B31V1: AB31.AU1 AB31.BV1
C34D1: AB31.AV2 C34.D1
C34E1: AB31.AT2 C34.E1
GND [Supply]: C34.C1 C34.T1 ; also sheet 1,3,8,9,10,11,12,13,14,15,16,19,20,23
IOP1: AB31.AR2 ; also sheet 1,13,14,22,23
IOP2: AB31.AR1 ; also sheet 1,13,14,20,22
IOP4: AB31.AP2 ; also sheet 1,13,14,22,23
MB07: AB31.BE2 ; also sheet 3,5,7,12,13,23
PB0: AB31.AK1 C34.H1
PB1: AB31.AL1 C34.J1
PB2: AB31.AM1 C34.K1
PB3: AB31.AN1 C34.L1
PB4: AB31.AK2 C34.N1
PB5: AB31.AL2 C34.P1
PB6: AB31.AM2 C34.R1
PB7: AB31.AN2 C34.S1
Unconnected: AB31.AJ1 AB31.AJ2 AB31.AS1 AB31.AU2 C34.A1 C34.A2 C34.B1 C34.C2 C34.F1 C34.V1

### Notes on the sheet
- Punch Control

## Sheet 22 of 23
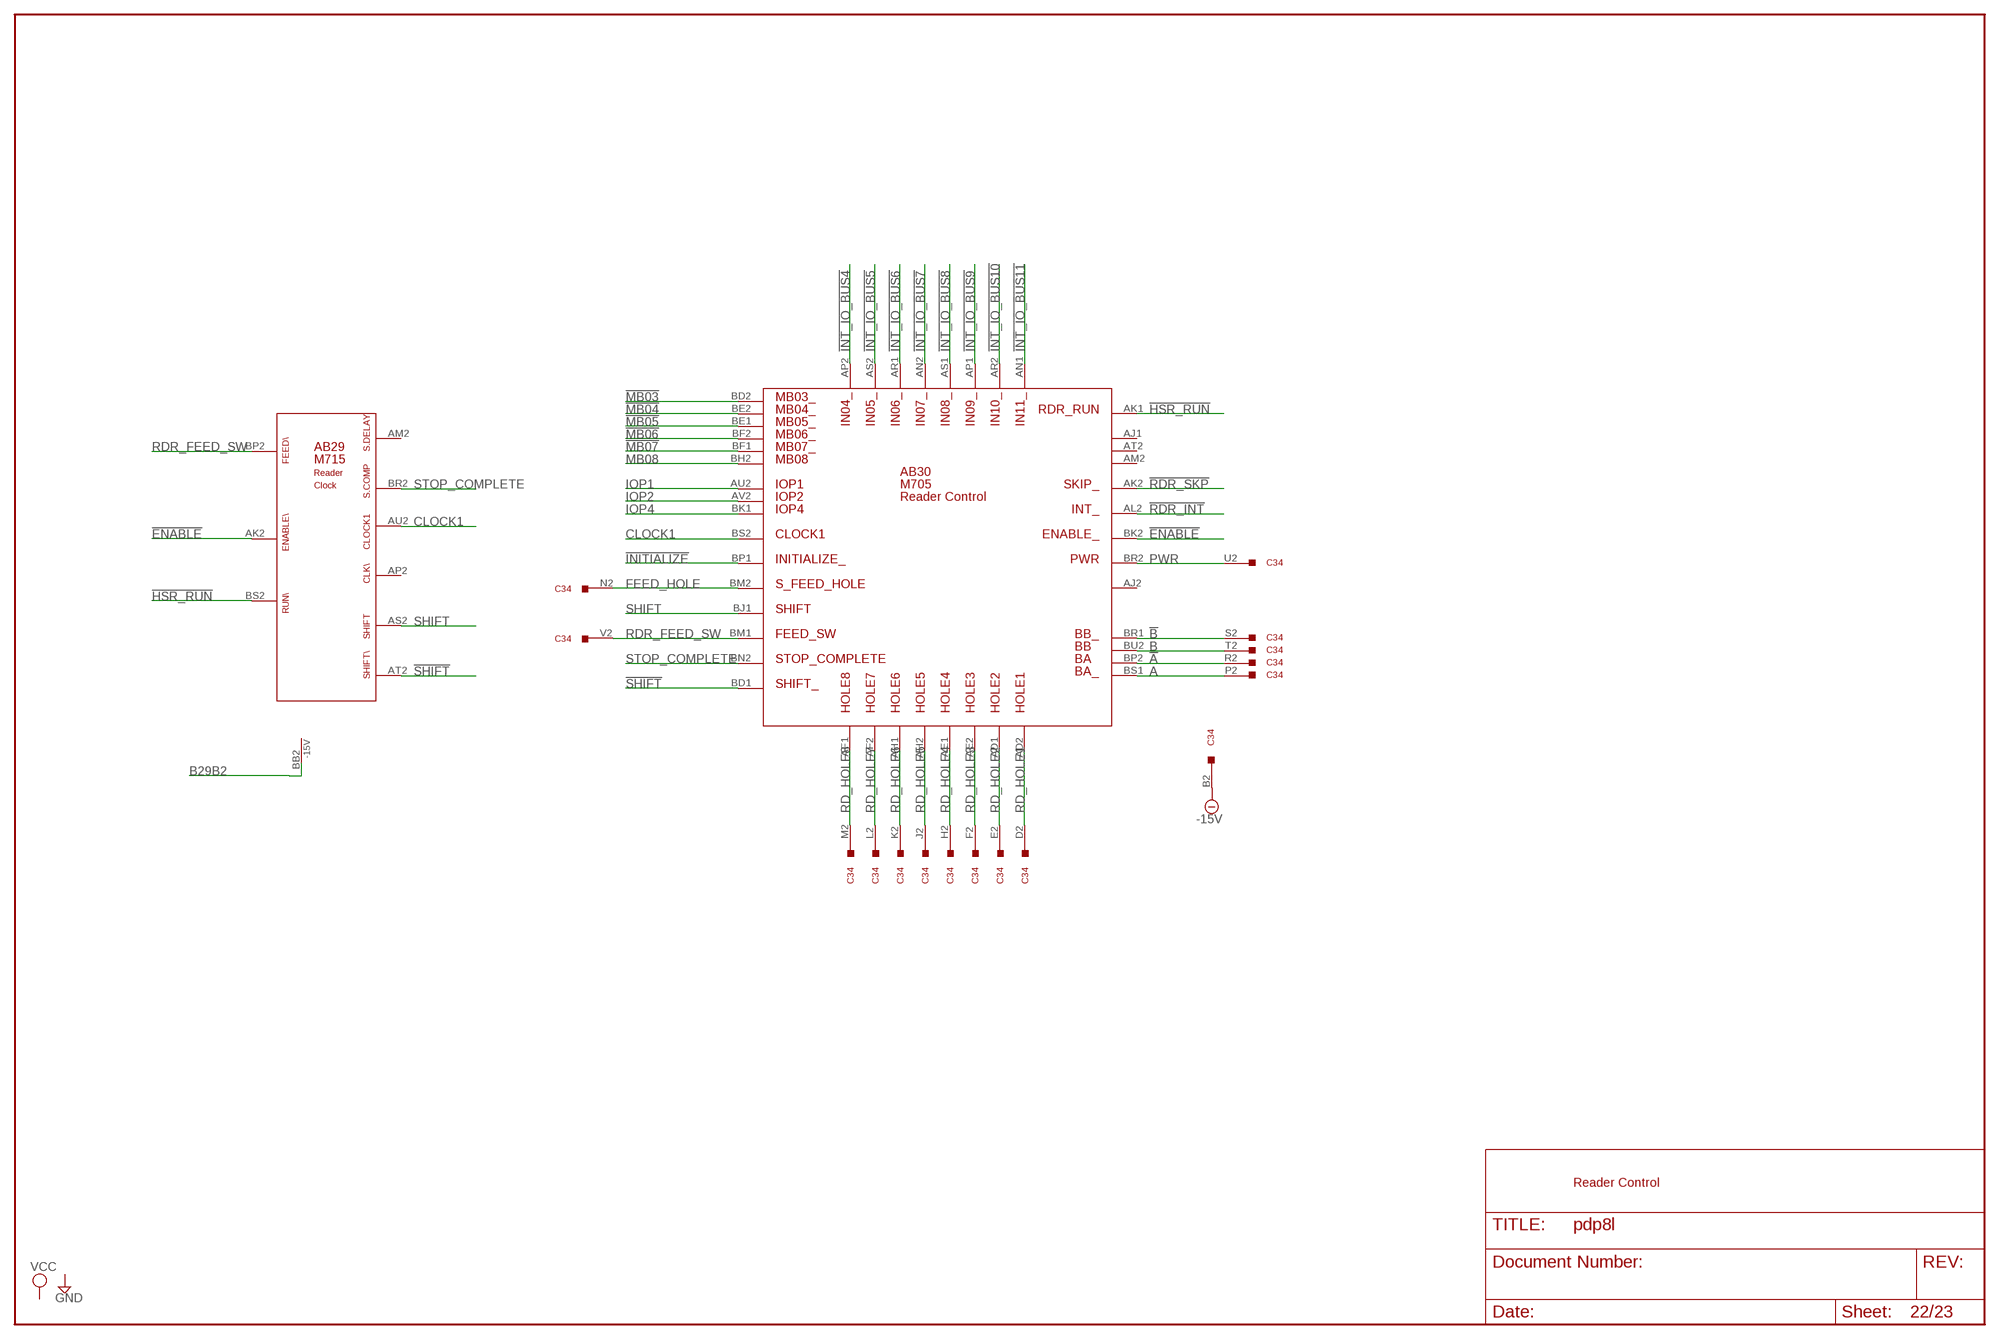
[diagram p21: schematic, sheet 22]

### Parts
AB29  M715  [H807-2]
AB30  M705  [H807-2]

### Nets
!A: AB30.BP2 C34.R2
!B: AB30.BR1 C34.S2
!ENABLE: AB29.AK2(AK) AB30.BK2
!HSR_RUN: AB29.BS2(BS) AB30.AK1
!INITIALIZE: AB30.BP1 ; also sheet 1,12,21
!INT_IO_BUS4: AB30.AP2 ; also sheet 12
!INT_IO_BUS5: AB30.AS2 ; also sheet 12
!INT_IO_BUS6: AB30.AR1 ; also sheet 12
!INT_IO_BUS7: AB30.AN2 ; also sheet 12
!INT_IO_BUS8: AB30.AS1 ; also sheet 12
!INT_IO_BUS9: AB30.AP1 ; also sheet 12
!INT_IO_BUS10: AB30.AR2 ; also sheet 12
!INT_IO_BUS11: AB30.AN1 ; also sheet 12
!MB03: AB30.BD2 ; also sheet 2,3,6,7,12,13,14,16,20,21,23
!MB04: AB30.BE2 ; also sheet 3,6,7,12,13,14,16,20,21,23
!MB05: AB30.BE1 ; also sheet 3,6,7,12,13,14,16,21,23
!MB06: AB30.BF2 ; also sheet 3,6,7,12,13,16,20,21,23
!MB07: AB30.BF1 ; also sheet 3,6,7,12,14,16,20,23
!RDR_INT: AB30.AL2 ; also sheet 12,21
!RDR_SKP: AB30.AK2 ; also sheet 12,21
!SHIFT: AB29.AT2(AT) AB30.BD1
-15V [Supply]: C34.B2 ; also sheet 13
A: AB30.BS1 C34.P2
B: AB30.BU2 C34.T2
B29B2 [Supply]: AB29.BB2(-15V) ; also sheet 15
CLOCK1: AB29.AU2(AU) AB30.BS2
FEED_HOLE: AB30.BM2 C34.N2
IOP1: AB30.AU2 ; also sheet 1,13,14,21,23
IOP2: AB30.AV2 ; also sheet 1,13,14,20,21
IOP4: AB30.BK1 ; also sheet 1,13,14,21,23
MB08: AB30.BH2 ; also sheet 4,5,7,12,13,23
PWR: AB30.BR2 C34.U2
RD_HOLE1: AB30.AD2 C34.D2
RD_HOLE2: AB30.AD1 C34.E2
RD_HOLE3: AB30.AE2 C34.F2
RD_HOLE4: AB30.AE1 C34.H2
RD_HOLE5: AB30.AH2 C34.J2
RD_HOLE6: AB30.AH1 C34.K2
RD_HOLE7: AB30.AF2 C34.L2
RD_HOLE8: AB30.AF1 C34.M2
RDR_FEED_SW: AB29.BP2(BP) AB30.BM1 C34.V2
SHIFT: AB29.AS2(AS) AB30.BJ1
STOP_COMPLETE: AB29.BR2(BR) AB30.BN2
Unconnected: AB29.AM2(AM) AB29.AP2(AP) AB30.AJ1 AB30.AJ2 AB30.AM2 AB30.AT2

### Notes on the sheet
- Reader Control

## Sheet 23 of 23
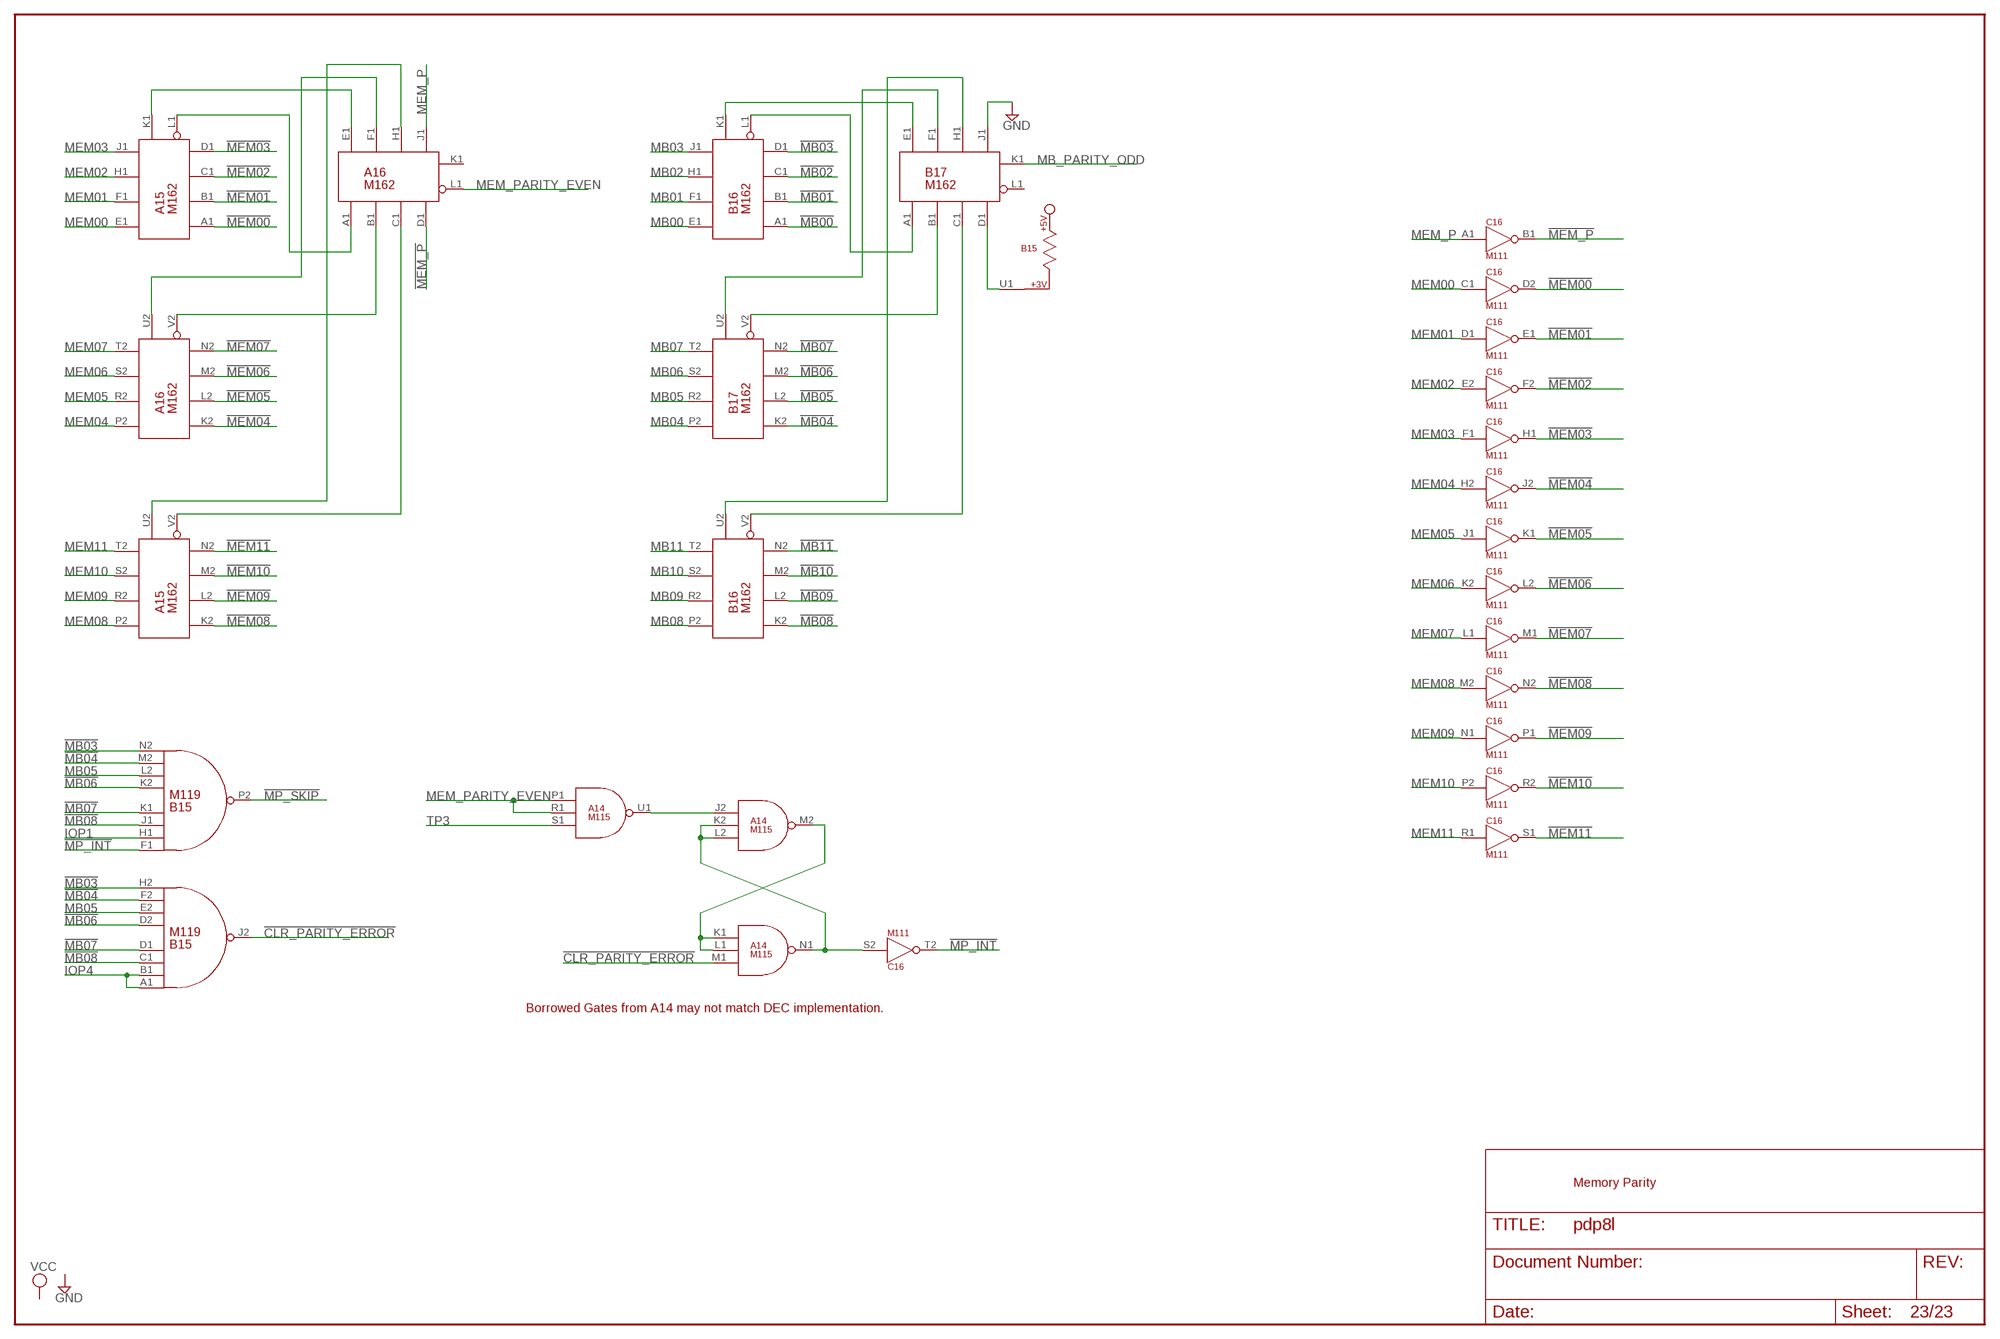
[diagram p22: schematic, sheet 23]

### Parts
A15  M162  [H807]
A16  M162  [H807]
B15  M119  [H807]
B16  M162  [H807]
B17  M162  [H807]
C16  M111  [H807]

### Nets
!CLR_PARITY_ERROR: A14.M1(N1:IN3) B15.J2(J2:OUT)
!MB00: B16.A1(K1:1B) ; also sheet 7,16
!MB01: B16.B1(K1:2B) ; also sheet 7,16
!MB02: B16.C1(K1:4B) ; also sheet 7,16
!MB03: B15.H2(J2:IN8) B15.N2(P2:IN8) B16.D1(K1:8B) ; also sheet 2,3,6,7,12,13,14,16,20,21,22
!MB04: B15.F2(J2:IN7) B15.M2(P2:IN7) B17.K2(U2:1B) ; also sheet 3,6,7,12,13,14,16,20,21,22
!MB05: B17.L2(U2:2B) ; also sheet 3,6,7,12,13,14,16,21,22
!MB06: B15.D2(J2:IN5) B15.K2(P2:IN5) B17.M2(U2:4B) ; also sheet 3,6,7,12,13,16,20,21,22
!MB07: B15.D1(J2:IN4) B15.K1(P2:IN4) B17.N2(U2:8B) ; also sheet 3,6,7,12,14,16,20,22
!MB08: B15.C1(J2:IN3) B15.J1(P2:IN3) B16.K2(U2:1B) ; also sheet 4,5,6,7,12,14,16,20,21
!MB09: B16.L2(U2:2B) ; also sheet 4,7,16
!MB10: B16.M2(U2:4B) ; also sheet 4,6,7,16
!MB11: B16.N2(U2:8B) ; also sheet 1,2,3,6,7,16
!MEM00: A15.A1(K1:1B) C16.D2(D2:OUT)
!MEM01: A15.B1(K1:2B) C16.E1(E1:OUT)
!MEM02: A15.C1(K1:4B) C16.F2(F2:OUT)
!MEM03: A15.D1(K1:8B) C16.H1(H1:OUT)
!MEM04: A16.K2(U2:1B) C16.J2(J2:OUT)
!MEM05: A16.L2(U2:2B) C16.K1(K1:OUT)
!MEM06: A16.M2(U2:4B) C16.L2(L2:OUT)
!MEM07: A16.N2(U2:8B) C16.M1(M1:OUT)
!MEM08: A15.K2(U2:1B) C16.N2(N2:OUT)
!MEM09: A15.L2(U2:2B) C16.P1(P1:OUT)
!MEM10: A15.M2(U2:4B) C16.R2(R2:OUT)
!MEM11: A15.N2(U2:8B) C16.S1(S1:OUT)
!MEM_P: A16.D1(K1:8B) C16.B1(B1:OUT)
!MP_INT: B15.F1(P2:IN1) C16.T2(T2:OUT) ; also sheet 14
!MP_SKIP: B15.P2(P2:OUT) ; also sheet 14
A14M2: A14.K1(N1:IN1) A14.L1(N1:IN2) A14.M2(M2:OUT)
A14U1: A14.J2(M2:IN1) A14.U1(U1:OUT)
A15K1: A15.K1(K1:ODD) A16.E1(K1:1A)
A15L1: A15.L1(K1:EVEN) A16.A1(K1:1B)
A15U2: A15.U2(U2:ODD) A16.H1(K1:4A)
A15V2: A15.V2(U2:EVEN) A16.C1(K1:4B)
A16U2: A16.F1(K1:2A) A16.U2(U2:ODD)
A16V2: A16.B1(K1:2B) A16.V2(U2:EVEN)
B15U1: B15.U1 B17.D1(K1:8B)
B16K1: B16.K1(K1:ODD) B17.E1(K1:1A)
B16L1: B16.L1(K1:EVEN) B17.A1(K1:1B)
B16U2: B16.U2(U2:ODD) B17.H1(K1:4A)
B16V2: B16.V2(U2:EVEN) B17.C1(K1:4B)
B17U2: B17.F1(K1:2A) B17.U2(U2:ODD)
B17V2: B17.B1(K1:2B) B17.V2(U2:EVEN)
GND [Supply]: B17.J1(K1:8A) ; also sheet 1,3,8,9,10,11,12,13,14,15,16,19,20,21
IOP1: B15.H1(P2:IN2) ; also sheet 1,13,14,21,22
IOP4: B15.A1(J2:IN1) B15.B1(J2:IN2) ; also sheet 1,13,14,21,22
MB00: B16.E1(K1:1A) ; also sheet 7,12
MB01: B16.F1(K1:2A) ; also sheet 7,12
MB02: B16.H1(K1:4A) ; also sheet 7,12
MB03: B16.J1(K1:8A) ; also sheet 2,7,12
MB04: B17.P2(U2:1A) ; also sheet 3,7,12
MB05: B15.E2(J2:IN6) B15.L2(P2:IN6) B17.R2(U2:2A) ; also sheet 3,5,7,12,20
MB06: B17.S2(U2:4A) ; also sheet 3,5,7,12,14
MB07: B17.T2(U2:8A) ; also sheet 3,5,7,12,13,21
MB08: B16.P2(U2:1A) ; also sheet 4,5,7,12,13,22
MB09: B16.R2(U2:2A) ; also sheet 1,3,4,7,12
MB10: B16.S2(U2:4A) ; also sheet 1,4,7,12
MB11: B16.T2(U2:8A) ; also sheet 1,4,7,12
MB_PARITY_ODD: B17.K1(K1:ODD) ; also sheet 16
MEM00: A15.E1(K1:1A) C16.C1(D2:IN) ; also sheet 2,8,16
MEM01: A15.F1(K1:2A) C16.D1(E1:IN) ; also sheet 2,8,16
MEM02: A15.H1(K1:4A) C16.E2(F2:IN) ; also sheet 2,8,16
MEM03: A15.J1(K1:8A) C16.F1(H1:IN) ; also sheet 9,16
MEM04: A16.P2(U2:1A) C16.H2(J2:IN) ; also sheet 9,16
MEM05: A16.R2(U2:2A) C16.J1(K1:IN) ; also sheet 9,16
MEM06: A16.S2(U2:4A) C16.K2(L2:IN) ; also sheet 10,16
MEM07: A16.T2(U2:8A) C16.L1(M1:IN) ; also sheet 10,16
MEM08: A15.P2(U2:1A) C16.M2(N2:IN) ; also sheet 10,16
MEM09: A15.R2(U2:2A) C16.N1(P1:IN) ; also sheet 11,16
MEM10: A15.S2(U2:4A) C16.P2(R2:IN) ; also sheet 11,16
MEM11: A15.T2(U2:8A) C16.R1(S1:IN) ; also sheet 11,16
MEM_P: A16.J1(K1:8A) C16.A1(B1:IN) ; also sheet 16
MEM_PARITY_EVEN: A14.P1(U1:IN1) A14.R1(U1:IN2) A16.L1(K1:EVEN)
MP_INT: A14.K2(M2:IN2) A14.L2(M2:IN3) A14.N1(N1:OUT) C16.S2(T2:IN)
TP3: A14.S1(U1:IN3) ; also sheet 1,5
Unconnected: A16.K1(K1:ODD) B15.M1(V2:IN1) B15.N1(V2:IN2) B15.P1(V2:IN3) B15.R1(V2:IN4) B15.R2(V2:IN5) B15.S2(V2:IN6) B15.T2(V2:IN7) B15.U2(V2:IN8) B15.V1 B15.V2(V2:OUT) B17.L1(K1:EVEN) C16.U1(U1:OUT) C16.U2(V2:IN) C16.V1(U1:IN) C16.V2(V2:OUT)

### Notes on the sheet
- Borrowed Gates from A14 may not match DEC implementation.
- Memory Parity

## Power pins joined to a net without a drawn wire
-15V: A17.B2(-15V) A18.B2(-15V) A19.B2(-15V) A20.B2(-15V) B18.B2(-15V) B19.B2(-15V) B20.B2(-15V)
GND: A08.C2(GND) A08.T1(GND) A09.C2(GND) A09.T1(GND) A10.C2(GND) A10.T1(GND) A11.C2(GND) A11.T1(GND) A12.C2(GND) A12.T1(GND) A13.C2(GND) A13.T1(GND) A14.C2(GND) A14.T1(GND) A15.C2(GND) A15.T1(GND) A16.C2(GND) A16.T1(GND) A17.C2(GND) A17.T1(GND) A18.C2(GND) A18.T1(GND) A19.C2(GND) A19.T1(GND) A20.C2(GND) A20.T1(GND) A23.C2(C2:GND) A23.T1(T1:GND) A24.C2(C2:GND) A24.T1(T1:GND) A32.C2(GND) A32.T1(GND) A33.C2(GND) A33.T1(GND) A34.C2(GND) A34.T1(GND) A35.C2(GND) A35.T1(GND) AB02.AC2(GND) AB02.AT1(GND) AB02.BC2(GND) AB02.BT1(GND) AB03.AC2(GND) AB03.AT1(GND) AB03.BC2(GND) AB03.BT1(GND) AB04.AC2(GND) AB04.AT1(GND) AB04.BC2(GND) AB04.BT1(GND) AB05.AC2(GND) AB05.AT1(GND) AB05.BC2(GND) AB05.BT1(GND) AB06.AC2(GND) AB06.AT1(GND) AB06.BC2(GND) AB06.BT1(GND) AB07.AC2(GND) AB07.AT1(GND) AB07.BC2(GND) AB07.BT1(GND) AB29.AC2(GND) AB29.BC2(GND) AB30.AC2(GND) AB30.AT1(GND) AB30.BC2(GND) AB30.BT1(GND) AB31.AC2(GND) AB31.AT1(GND) AB31.BC2(GND) AB31.BT1(GND) B08.C2(GND) B08.T1(GND) B09.C2(GND) B09.T1(GND) B10.C2(GND) B10.T1(GND) B11.C2(GND) B11.T1(GND) B12.C2(GND) B12.T1(GND) B13.C2(GND) B13.T1(GND) B14.C2(GND) B14.T1(GND) B15.C2(GND) B15.T1(GND) B16.C2(GND) B16.T1(GND) B17.C2(GND) B17.T1(GND) B18.C2(GND) B18.T1(GND) B19.C2(GND) B19.T1(GND) B20.C2(GND) B20.T1(GND) B23.C2(C2:GND) B23.T1(T1:GND) B24.C2(C2:GND) B24.T1(T1:GND) B32.A1(A1:GND) B32.C1(C1:GND) B32.C2(GND) B32.F1(F1:GND) B32.F2(F2:GND) B32.J2(J2:GND) B32.K1(K1:GND) B32.L2(L2:GND) B32.N1(N1:GND) B32.N2(N2:GND) B32.R1(R1:GND) B32.R2(R2:GND) B32.T1(T1:GND) B32.U2(U2:GND) B33.A1(A1:GND) B33.C1(C1:GND) B33.C2(GND) B33.F1(F1:GND) B33.F2(F2:GND) B33.J2(J2:GND) B33.K1(K1:GND) B33.L2(L2:GND) B33.N1(N1:GND) B33.N2(N2:GND) B33.R1(R1:GND) B33.R2(R2:GND) B33.T1(T1:GND) B33.U2(U2:GND) B34.A1 B34.C1 B34.C2 B34.F1 B34.F2 B34.J2 B34.K1 B34.L2 B34.N1 B34.N2 B34.R1 B34.R2 B34.T1 B34.U2 B35.A1 B35.C1 B35.C2 B35.F1 B35.F2 B35.J2 B35.K1 B35.L2 B35.N1 B35.N2 B35.R1 B35.R2 B35.T1 B35.U2 B36.A1 B36.C1 B36.C2 B36.F1 B36.F2 B36.J2 B36.K1 B36.L2 B36.N1 B36.N2 B36.R1 B36.R2 B36.T1 B36.U2 C02.C2(GND) C02.T1(GND) C04.C2(GND) C04.T1(GND) C05.C2(GND) C05.T1(GND) C06.C2(GND) C06.T1(GND) C07.C2(GND) C07.T1(GND) C08.C2(GND) C08.T1(GND) C09.C2(GND) C09.T1(GND) C10.C2(GND) C10.T1(GND) C11.C2(GND) C11.T1(GND) C12.C2(GND) C12.T1(GND) C13.C2(GND) C13.T1(GND) C14.C2(GND) C14.T1(GND) C15.C2(GND) C15.T1(GND) C16.C2(GND) C16.T1(GND) C17.C2(GND) C18.C2(GND) C19.C2(GND) C23.C2(GND) C24.C2(GND) C25.C2(C2:GND) C25.T1(T1:GND) C26.C2(GND) C27.C2(GND) C27.T1(GND) C27.U1(GND) C27.V1(GND) C28.C2(GND) C28.T1(GND) C29.C2(GND) C30.C2(GND) C35.A1 C35.C1 C35.C2 C35.F1 C35.F2 C35.J2 C35.K1 C35.L2 C35.N1 C35.N2 C35.R1 C35.R2 C35.T1 C35.U2 C36.A1 C36.C1 C36.C2 C36.F1 C36.F2 C36.J2 C36.K1 C36.L2 C36.N1 C36.N2 C36.R1 C36.R2 C36.T1 C36.U2 CD03.AC2(GND) CD03.BC2(GND) D02.C2(GND) D02.T1(GND) D04.C2(GND) D04.T1(GND) D05.C2(GND) D05.T1(GND) D06.C2(GND) D06.T1(GND) D07.C2(GND) D07.T1(GND) D08.C2(GND) D08.T1(GND) D09.C2(GND) D09.T1(GND) D10.C2(GND) D10.T1(GND) D11.C2(GND) D11.T1(GND) D12.C2(GND) D12.T1(GND) D13.C2(GND) D13.T1(GND) D14.C2(GND) D14.T1(GND) D15.C2(GND) D15.T1(GND) D16.C2(GND) D16.T1(GND) D17.C2(GND) D17.T1(GND) D18.C2(GND) D19.C2(GND) D23.C2(GND) D24.C2(GND) D25.C2(C2:GND) D25.T1(T1:GND) D27.C2(GND) D27.T1(GND) D27.U1(GND) D27.V1(GND) D28.C2(GND) D28.T1(GND) D28.U1(GND) D28.V1(GND) D29.A1(A1:GND) D29.C1(C1:GND) D29.C2(GND) D29.F1(F1:GND) D29.F2(F2:GND) D29.J2(J2:GND) D29.K1(K1:GND) D29.L2(L2:GND) D29.N1(N1:GND) D29.N2(N2:GND) D29.R1(R1:GND) D29.R2(R2:GND) D29.T1(T1:GND) D29.U2(U2:GND) D30.A1(A1:GND) D30.C1(C1:GND) D30.C2(GND) D30.F1(F1:GND) D30.F2(F2:GND) D30.J2(J2:GND) D30.K1(K1:GND) D30.L2(L2:GND) D30.N1(N1:GND) D30.N2(N2:GND) D30.R1(R1:GND) D30.R2(R2:GND) D30.T1(T1:GND) D30.U2(U2:GND) D34.A1 D34.C1 D34.C2 D34.F1 D34.F2 D34.J2 D34.K1 D34.L2 D34.N1 D34.N2 D34.R1 D34.R2 D34.T1 D34.U2 D35.A1 D35.C1 D35.C2 D35.F1 D35.F2 D35.J2 D35.K1 D35.L2 D35.N1 D35.N2 D35.R1 D35.R2 D35.T1 D35.U2 D36.A1 D36.C1 D36.C2 D36.F1 D36.F2 D36.J2 D36.K1 D36.L2 D36.N1 D36.N2 D36.R1 D36.R2 D36.T1 D36.U2
VCC: A08.A2(VCC) A09.A2(VCC) A10.A2(VCC) A11.A2(VCC) A12.A2(VCC) A13.A2(VCC) A14.A2(VCC) A15.A2(VCC) A16.A2(VCC) A17.A2(VCC) A18.A2(VCC) A19.A2(VCC) A20.A2(VCC) A23.A2(C2:VCC) A24.A2(C2:VCC) A32.A2(VCC) A33.A2(VCC) A34.A2(VCC) A35.A2(VCC) AB02.AA2(VCC) AB02.BA2(VCC) AB03.AA2(VCC) AB03.BA2(VCC) AB04.AA2(VCC) AB04.BA2(VCC) AB05.AA2(VCC) AB05.BA2(VCC) AB06.AA2(VCC) AB06.BA2(VCC) AB07.AA2(VCC) AB07.BA2(VCC) AB29.AA2(VCC) AB29.BA2(VCC) AB30.AA2(VCC) AB30.BA2(VCC) AB31.AA2(VCC) AB31.BA2(VCC) B08.A2(VCC) B09.A2(VCC) B10.A2(VCC) B11.A2(VCC) B12.A2(VCC) B13.A2(VCC) B14.A2(VCC) B15.A2(VCC) B16.A2(VCC) B17.A2(VCC) B18.A2(VCC) B19.A2(VCC) B20.A2(VCC) B23.A2(C2:VCC) B24.A2(C2:VCC) B32.A2(VCC) B33.A2(VCC) C02.A2(VCC) C04.A2(VCC) C05.A2(VCC) C06.A2(VCC) C07.A2(VCC) C08.A2(VCC) C09.A2(VCC) C10.A2(VCC) C11.A2(VCC) C12.A2(VCC) C13.A2(VCC) C14.A2(VCC) C15.A2(VCC) C16.A2(VCC) C17.A2(VCC) C18.A2(VCC) C19.A2(VCC) C23.A2(VCC) C24.A2(VCC) C25.A2(C2:VCC) C26.A2(VCC) C27.A2(VCC) C28.A2(VCC) C29.A2(VCC) C30.A2(VCC) CD03.AA2(VCC) CD03.BA2(VCC) D02.A2(VCC) D04.A2(VCC) D05.A2(VCC) D06.A2(VCC) D07.A2(VCC) D08.A2(VCC) D09.A2(VCC) D10.A2(VCC) D11.A2(VCC) D12.A2(VCC) D13.A2(VCC) D14.A2(VCC) D15.A2(VCC) D16.A2(VCC) D17.A2(VCC) D18.A2(VCC) D19.A2(VCC) D23.A2(VCC) D24.A2(VCC) D25.A2(C2:VCC) D27.A2(VCC) D28.A2(VCC) D29.A2(VCC) D30.A2(VCC)

## Library data of the parts
A01 A28 A36 B01 C01 C31 C32 C34 D01 D31 D32 = dec-m:M916: Simple 36 pin connector/wire cable
A08 A09 B08 B09 D17 = dec-m:M617: 6 4-input NAND Buffers
A10 A12 A13 B10 D09 = dec-m:M160: AND-NOR Gates
A11 A14 C09 C12 C28 D04 = dec-m:M115: 8 3-input NAND Gates
A15 A16 B16 B17 = dec-m:M162: Parity Circuit
A17-A20 B18-B20 = dec-m:G020: Sense Amps
A21 A22 A27 B21 B22 B27 B28 C20 C22 C33 D20 D22 D33 = dec-m:W023: One-sided 18 pin connector/cable.
A23 A24 B23 B24 C25 D25 = dec-m:G228: Inhibit Driver
A25 A26 B25 B26 = dec-m:G624: Resistor Board
A32 A33 = dec-m:M516: Hex Positive Bus Receiver
A34 A35 B12 C07 C16 D02 D13 = dec-m:M111: Sixteen inverters.
AB02-AB07 = dec-m:M220: PDP-8 Major Registers
AB29 = dec-m:M715: Reader Clock
AB30 = dec-m:M705: Reader Control
AB31 = dec-m:M710: Punch Control
B11 C04 C06 C08 D10 D16 = dec-m:M206X: Two sets of 3 D flip-flops
B13 C02 C05 C14 C15 D11 D12 = dec-m:M113: 10 2-input NAND Gates
B14 B15 C10 = dec-m:M119: 3 8-input NAND Gates
B32 B33 D29 D30 = dec-m:M906: Cable Terminator
B34-B36 C35 C36 D34-D36 = dec-m:M903: Two-sided Posibus cable/connector.
C11 C13 = dec-m:M117: 6 4-input NAND Gates
C17 = dec-m:M360: Variable Delay
C18 C19 C23 C24 D18 D19 D23 D24 = dec-m:G221: Memory Selector
C21 D21 D26 = dec-m:H807: Empty card slot
C26 = dec-m:M002: 15 Clamped Loads
C27 D27 D28 = dec-m:M623: 6 Dual Bus Drivers
C29 C30 = dec-m:M660: Positive Level Driver
CD03 = dec-m:M700: Manual Function Timing and Run
D05-D08 D14 D15 = dec-m:M310: Tapped Delay Line

## Net classes
1 Supply: width 0.508 mm